# Altium project IncuNest.PrjPcb (part 1 of 2)
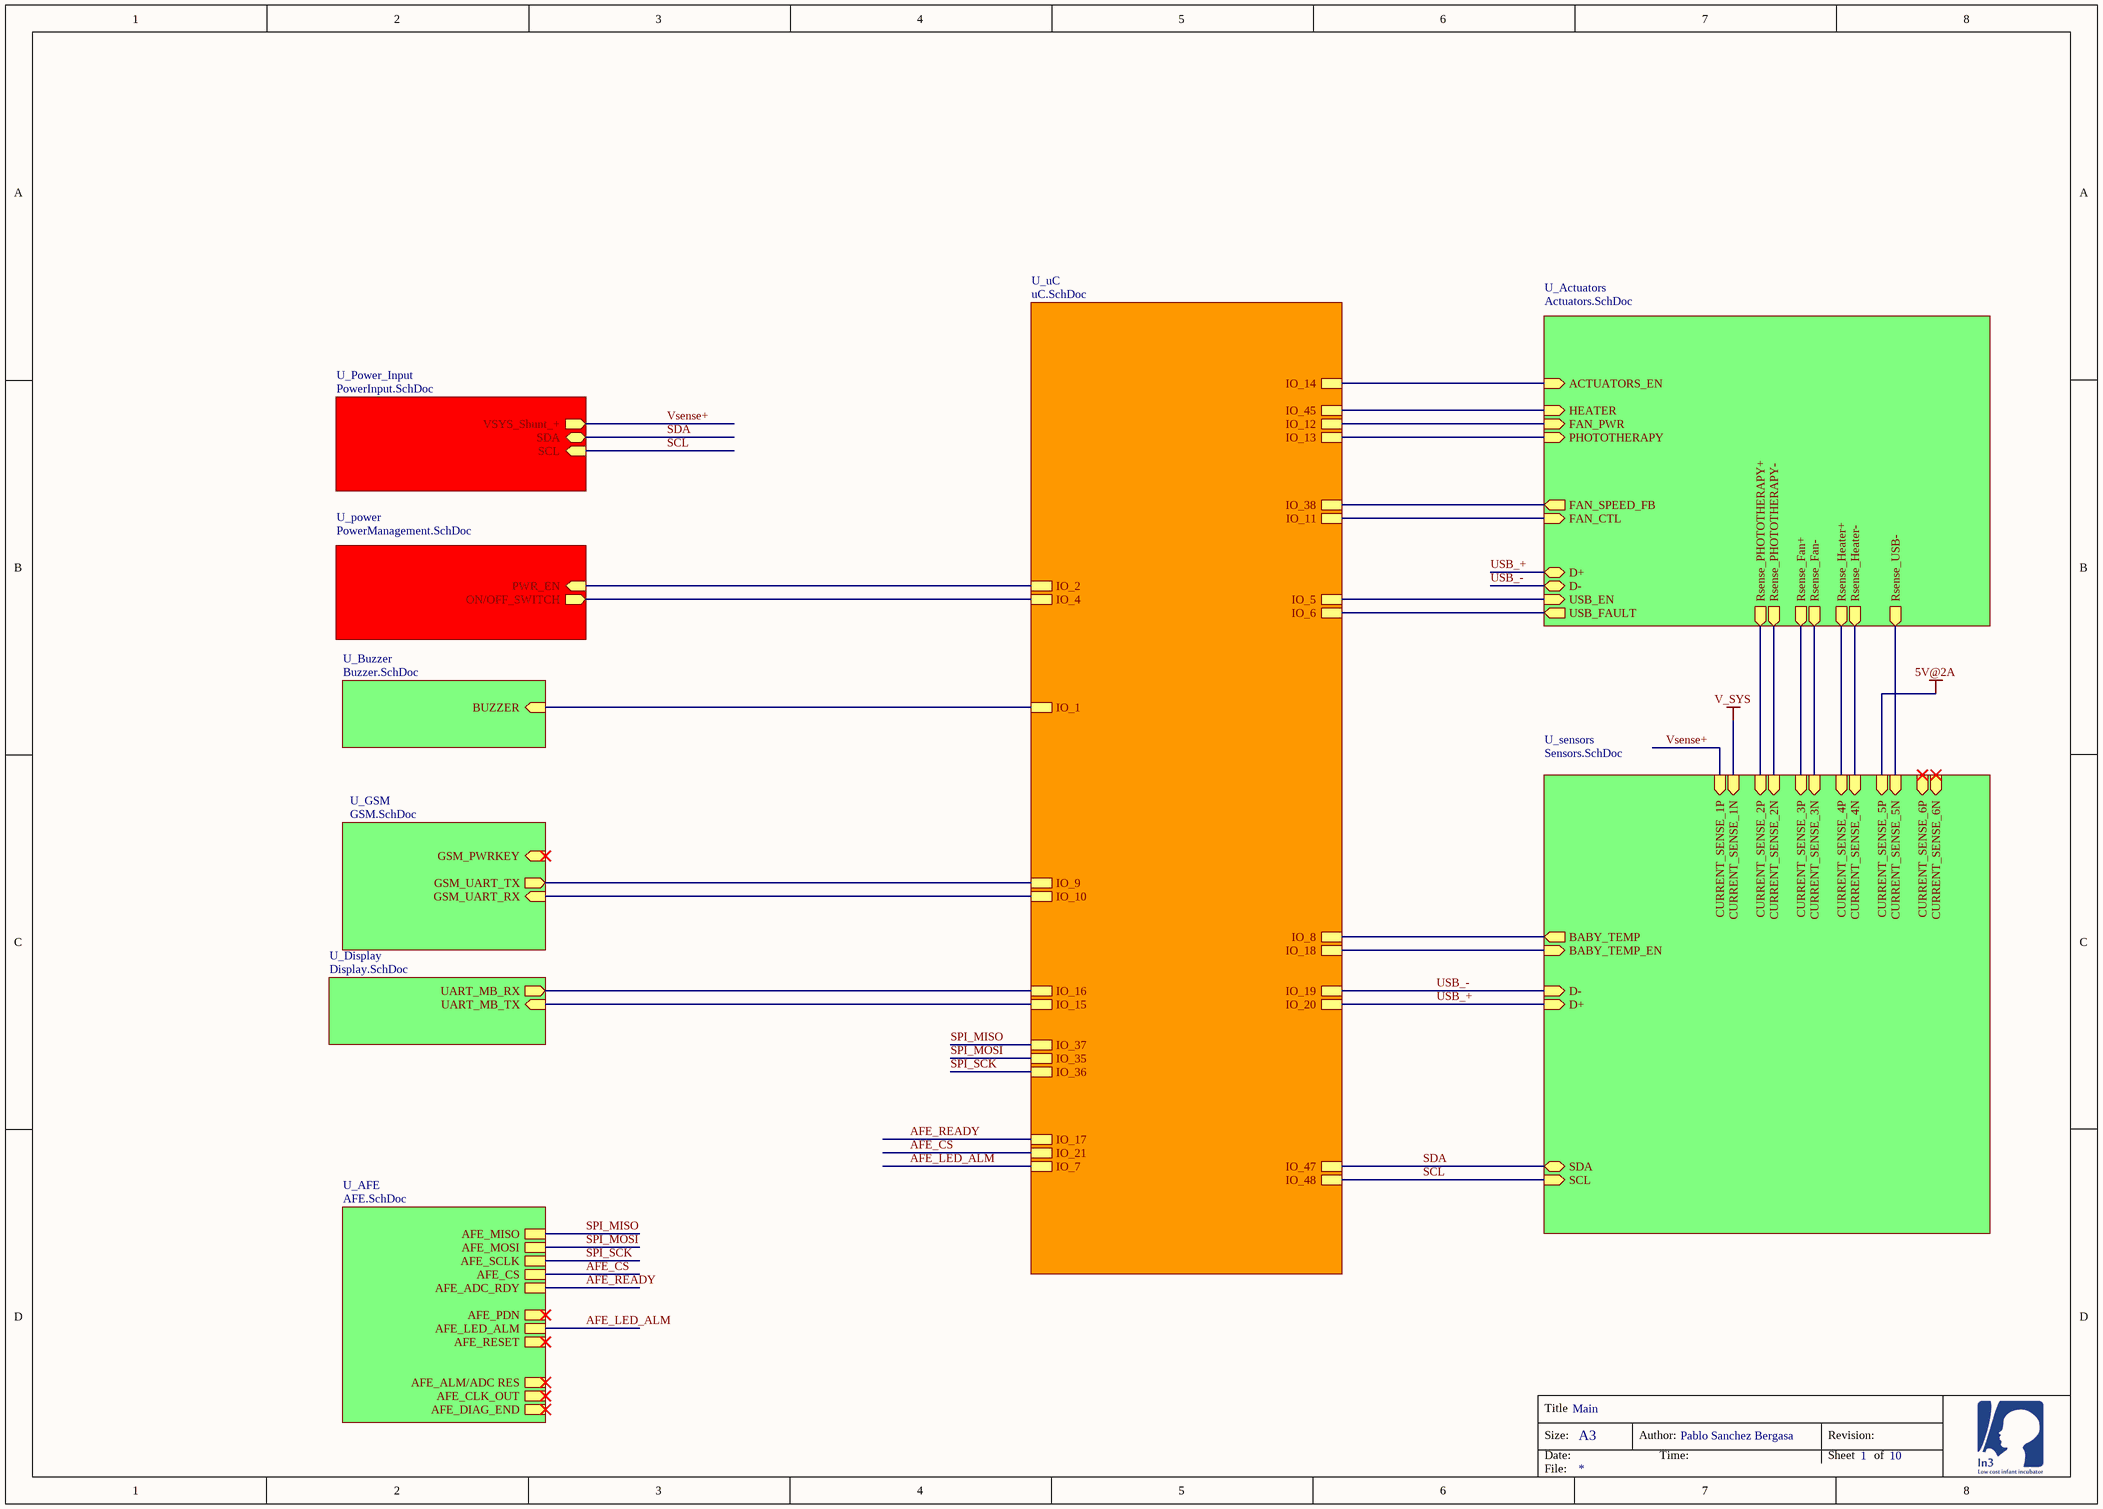
[diagram p0: Main.SchDoc]
Author_in3: Pablo Sanchez Bergasa; SheetTotal_in3: 10
10 sheets, 260 parts. Net scope: hierarchical (ports join the sheet entries above them; power ports are global).
Board file: Motherboard.PcbDoc
Sheets:
  Main.SchDoc
    U_power = PowerManagement.SchDoc
    U_GSM = GSM.SchDoc
    U_sensors = Sensors.SchDoc
    U_uC = uC.SchDoc
    U_Power_Input = PowerInput.SchDoc
    U_Actuators = Actuators.SchDoc
    U_Buzzer = Buzzer.SchDoc
    U_AFE = AFE.SchDoc
    U_Display = Display.SchDoc

## Sheet Main.SchDoc: Main
size A3; Date: 17/09/18; Author: Pablo Sánchez Bergasa; Revision: 2.A.1; SheetNumber: 1; SheetTotal: 10; DocumentName: Main

### Sub-sheets
U_Actuators = Actuators.SchDoc: HEATER (in), PHOTOTHERAPY (in), Rsense_Fan+ (out), Rsense_Fan- (out), Rsense_PHOTOTHERAPY+ (out), Rsense_PHOTOTHERAPY- (out), ACTUATORS_EN (in), FAN_SPEED_FB (out), Rsense_Heater- (out), Rsense_Heater+ (out), Rsense_USB- (out), USB_EN (in), USB_FAULT (out), FAN_PWR (in), FAN_CTL (in), D+ (bidir), D- (bidir)
U_AFE = AFE.SchDoc: AFE_SCLK, AFE_MISO, AFE_MOSI, AFE_CS, AFE_PDN, AFE_ADC_RDY, AFE_DIAG_END, AFE_LED_ALM, AFE_ALM/ADC RES, AFE_CLK_OUT, AFE_RESET
U_Buzzer = Buzzer.SchDoc: BUZZER (in)
U_Display = Display.SchDoc: UART_MB_TX (in), UART_MB_RX (out)
U_GSM = GSM.SchDoc: GSM_UART_TX (out), GSM_UART_RX (in), GSM_PWRKEY (in)
U_power = PowerManagement.SchDoc: PWR_EN (in), ON/OFF_SWITCH (out)
U_Power_Input = PowerInput.SchDoc: VSYS_Shunt_+ (out), SDA (bidir), SCL (in)
U_sensors = Sensors.SchDoc: BABY_TEMP (out), CURRENT_SENSE_1N (in), CURRENT_SENSE_3N (in), CURRENT_SENSE_2N (in), CURRENT_SENSE_1P (in), CURRENT_SENSE_3P (in), CURRENT_SENSE_2P (in), SCL (in), SDA (bidir), CURRENT_SENSE_6P (in), CURRENT_SENSE_5N (in), CURRENT_SENSE_4P (in), CURRENT_SENSE_4N (in), CURRENT_SENSE_6N (in), CURRENT_SENSE_5P (in), BABY_TEMP_EN (in), D+ (in), D- (in)
U_uC = uC.SchDoc: IO_5, IO_35, IO_37, IO_36, IO_7, IO_21, IO_15, IO_18, IO_14, IO_19, IO_20, IO_38, IO_13, IO_12, IO_16, IO_2, IO_1, IO_11, IO_4, IO_6, IO_8, IO_17, IO_45, IO_9, IO_10, IO_48, IO_47

### Nets
DC_ACTUATORS: sheet U_sensors/CURRENT_SENSE_3P, sheet U_sensors/CURRENT_SENSE_2P, sheet U_Actuators/Rsense_Fan+, sheet U_Actuators/Rsense_PHOTOTHERAPY+
AFE_CS: sheet U_uC/IO_21, sheet U_AFE/AFE_CS
AFE_LED_ALM: sheet U_uC/IO_7, sheet U_AFE/AFE_LED_ALM
AFE_READY: sheet U_uC/IO_17, sheet U_AFE/AFE_ADC_RDY
BABY_TEMP: sheet U_sensors/BABY_TEMP, sheet U_uC/IO_8
FAN+: sheet U_sensors/CURRENT_SENSE_3N, sheet U_Actuators/Rsense_Fan-
GSM_RX: sheet U_GSM/GSM_UART_RX, sheet U_uC/IO_10
GSM_TX: sheet U_GSM/GSM_UART_TX, sheet U_uC/IO_9
HEATER: sheet U_sensors/CURRENT_SENSE_4P, sheet U_Actuators/Rsense_Heater+
PHOTOTHERAPY+: sheet U_sensors/CURRENT_SENSE_2N, sheet U_Actuators/Rsense_PHOTOTHERAPY-
SCL: sheet U_sensors/SCL, sheet U_uC/IO_48, sheet U_Power_Input/SCL
SDA: sheet U_sensors/SDA, sheet U_uC/IO_47, sheet U_Power_Input/SDA
SPI_MISO: sheet U_uC/IO_37, sheet U_AFE/AFE_MISO
SPI_MOSI: sheet U_uC/IO_35, sheet U_AFE/AFE_MOSI
SPI_SCK: sheet U_uC/IO_36, sheet U_AFE/AFE_SCLK
USB_+: sheet U_sensors/D+, sheet U_uC/IO_20, sheet U_Actuators/D+  [project net D_P]
USB_-: sheet U_sensors/D-, sheet U_uC/IO_19, sheet U_Actuators/D-  [project net D_N]
Vsense+: sheet U_sensors/CURRENT_SENSE_1P, sheet U_Power_Input/VSYS_Shunt_+
NetD14_2: sheet U_power/PWR_EN, sheet U_uC/IO_2
NetJ5_3: sheet U_uC/IO_38, sheet U_Actuators/FAN_SPEED_FB
NetJ5_4: sheet U_uC/IO_11, sheet U_Actuators/FAN_CTL
NetJ10_4: sheet U_uC/IO_16, sheet U_Display/UART_MB_RX
NetJ10_6: sheet U_uC/IO_15, sheet U_Display/UART_MB_TX
NetQ2_4: sheet U_sensors/CURRENT_SENSE_4N, sheet U_Actuators/Rsense_Heater-
NetR3_2: sheet U_uC/IO_45, sheet U_Actuators/HEATER
NetR10_2: sheet U_uC/IO_14, sheet U_Actuators/ACTUATORS_EN
NetR14_1: sheet U_uC/IO_12, sheet U_Actuators/FAN_PWR
NetR19_2: sheet U_sensors/CURRENT_SENSE_5N, sheet U_Actuators/Rsense_USB-
NetR22_1: sheet U_uC/IO_13, sheet U_Actuators/PHOTOTHERAPY
NetR47_1: sheet U_uC/IO_1, sheet U_Buzzer/BUZZER
NetR75_1: sheet U_power/ON/OFF_SWITCH, sheet U_uC/IO_4
NetR83_2: sheet U_sensors/BABY_TEMP_EN, sheet U_uC/IO_18
NetU1_5: sheet U_uC/IO_5, sheet U_Actuators/USB_EN
NetU1_6: sheet U_uC/IO_6, sheet U_Actuators/USB_FAULT

### Notes on the sheet
- Title
- Size:
- Date:
- A3
- Author:
- Time:
- Revision:
- Sheet
- of
- File:

## Sheet PowerManagement.SchDoc: Power
size A3; SheetNumber: 3; SheetTotal: 10
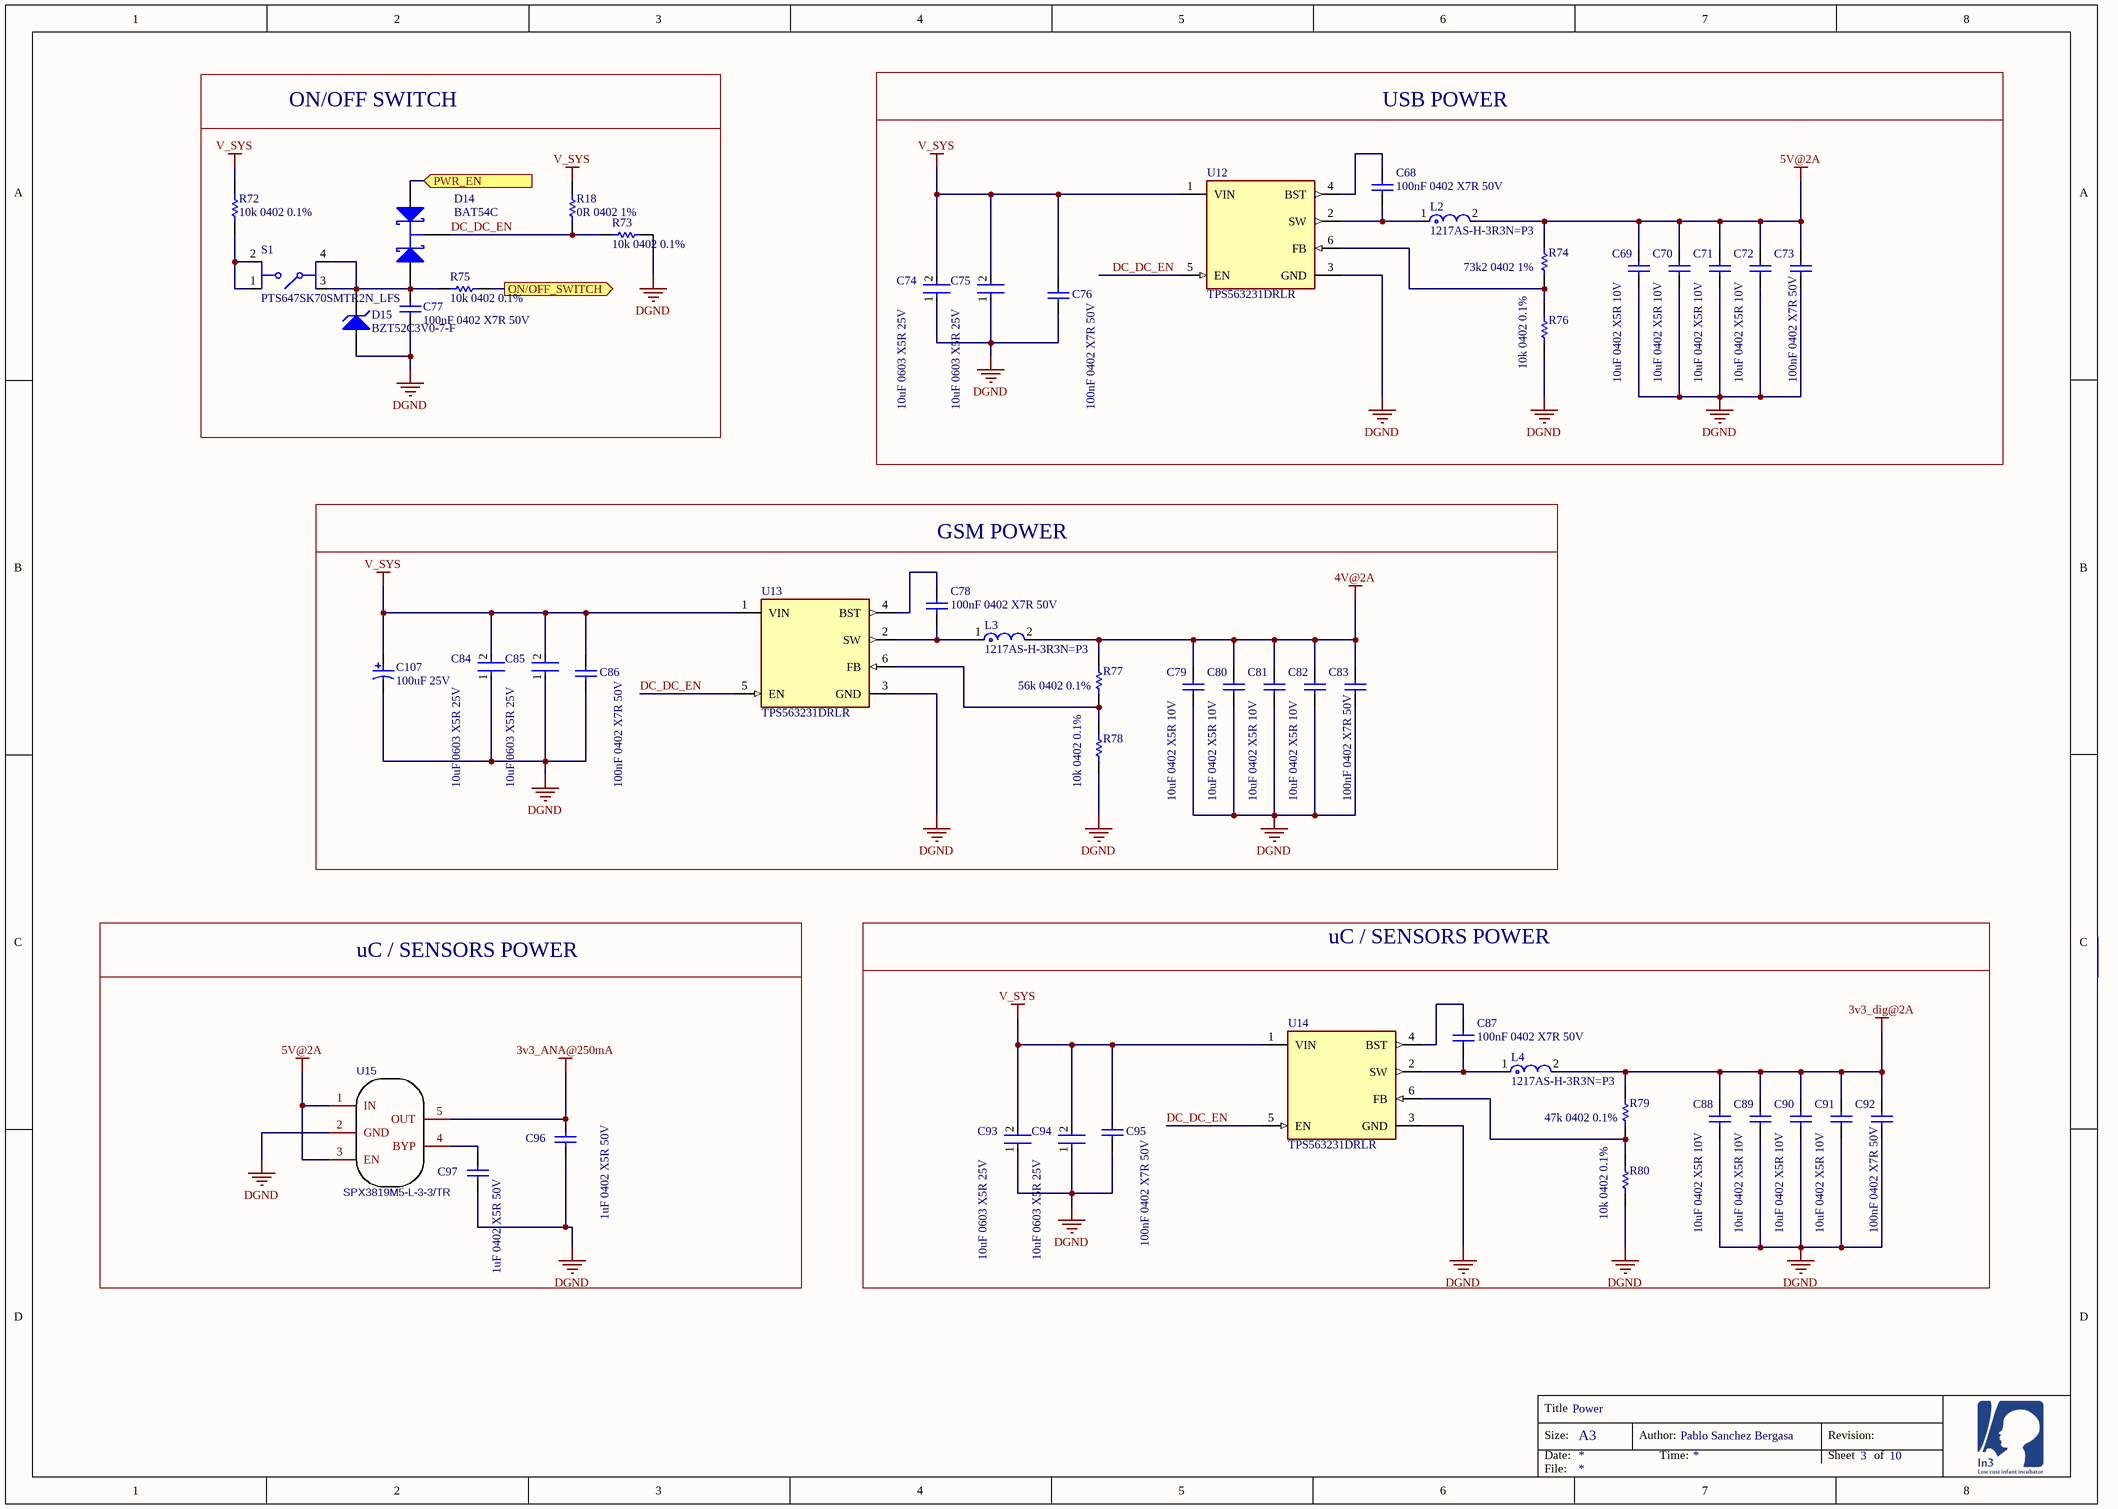
[diagram p1: PowerManagement.SchDoc]

### Parts
C68  100nF 0402 X7R 50V  [CAPC1005X55X25NL5T10]
C69  10uF 0402 X5R 10V  [CAPC1005X55X25NL5T10]
C70  10uF 0402 X5R 10V  [CAPC1005X55X25NL5T10]
C71  10uF 0402 X5R 10V  [CAPC1005X55X25NL5T10]
C72  10uF 0402 X5R 10V  [CAPC1005X55X25NL5T10]
C73  100nF 0402 X7R 50V  [CAPC1005X55X25NL5T10]
C74  10uF 0603 X5R 25V  [FP-GRM188-0_2-IPC_B]
C75  10uF 0603 X5R 25V  [FP-GRM188-0_2-IPC_B]
C76  100nF 0402 X7R 50V  [CAPC1005X55X25NL5T10]
C77  100nF 0402 X7R 50V  [CAPC1005X55X25NL5T10]
C78  100nF 0402 X7R 50V  [CAPC1005X55X25NL5T10]
C79  10uF 0402 X5R 10V  [CAPC1005X55X25NL5T10]
C80  10uF 0402 X5R 10V  [CAPC1005X55X25NL5T10]
C81  10uF 0402 X5R 10V  [CAPC1005X55X25NL5T10]
C82  10uF 0402 X5R 10V  [CAPC1005X55X25NL5T10]
C83  100nF 0402 X7R 50V  [CAPC1005X55X25NL5T10]
C84  10uF 0603 X5R 25V  [FP-GRM188-0_2-IPC_B]
C85  10uF 0603 X5R 25V  [FP-GRM188-0_2-IPC_B]
C86  100nF 0402 X7R 50V  [CAPC1005X55X25NL5T10]
C87  100nF 0402 X7R 50V  [CAPC1005X55X25NL5T10]
C88  10uF 0402 X5R 10V  [CAPC1005X55X25NL5T10]
C89  10uF 0402 X5R 10V  [CAPC1005X55X25NL5T10]
C90  10uF 0402 X5R 10V  [CAPC1005X55X25NL5T10]
C91  10uF 0402 X5R 10V  [CAPC1005X55X25NL5T10]
C92  100nF 0402 X7R 50V  [CAPC1005X55X25NL5T10]
C93  10uF 0603 X5R 25V  [FP-GRM188-0_2-IPC_B]
C94  10uF 0603 X5R 25V  [FP-GRM188-0_2-IPC_B]
C95  100nF 0402 X7R 50V  [CAPC1005X55X25NL5T10]
C96  1uF 0402 X5R 50V  [CAPC1005X55X25NL5T10]
C97  1uF 0402 X5R 50V  [CAPC1005X55X25NL5T10]
C107  100uF 25V  [CAPAE7067X55L]
D14  BAT54C  [NXP-SOT23-3_V]
D15  BZT52C3V0-7-F  [DIOD-SOD123_V]
L2  1217AS-H-3R3N=P3  [FP-DEM8045C-MFG]
L3  1217AS-H-3R3N=P3  [FP-DEM8045C-MFG]
L4  1217AS-H-3R3N=P3  [FP-DEM8045C-MFG]
R18  0R 0402 1%  [RESC1005X40X25ML05T10]
R72  10k 0402 0.1%  [RESC1005X40X25ML05T10]
R73  10k 0402 0.1%  [RESC1005X40X25ML05T10]
R74  73k2 0402 1%  [RESC1005X40X25ML05T10]
R75  10k 0402 0.1%  [RESC1005X40X25ML05T10]
R76  10k 0402 0.1%  [RESC1005X40X25ML05T10]
R77  56k 0402 0.1%  [RESC1005X40X25ML05T10]
R78  10k 0402 0.1%  [RESC1005X40X25ML05T10]
R79  47k 0402 0.1%  [RESC1005X40X25ML05T10]
R80  10k 0402 0.1%  [RESC1005X40X25ML05T10]
S1  PTS647SK70SMTR2N_LFS  [PTS647SK70SMTR2NLFS]
U12  TPS563231DRLR  [FP-DRL0006A-MFG]
U13  TPS563231DRLR  [FP-DRL0006A-MFG]
U14  TPS563231DRLR  [FP-DRL0006A-MFG]
U15  SPX3819M5-L-3-3/TR  [SOT-23-5_L3.0-W1.7-P0.95-LS2.8-BR]

### Blocks framed on the sheet
USB POWER: C68-C76 L2 R74 R76 U12
ON/OFF SWITCH: C77 D14 D15 R18 R72 R73 R75 S1
GSM POWER: C78-C86 C107 L3 R77 R78 U13
uC / SENSORS POWER: C87-C95 L4 R79 R80 U14
uC / SENSORS POWER: C96 C97 U15

### Ports
ON/OFF_SWITCH (out), PWR_EN (in)

### Nets
3v3_ANA@250mA: C96.2 U15.5(OUT)
3v3_dig@2A: C88.2 C89.2 C90.2 C91.2 C92.2 L4.2 R79.2
4V@2A: C79.2 C80.2 C81.2 C82.2 C83.2 L3.2 R77.2
5V@2A: C69.2 C70.2 C71.2 C72.2 C73.2 L2.2 R74.2 U15.1(IN) U15.3(EN)
DGND: C69.1 C70.1 C71.1 C72.1 C73.1 C74.1 C75.1 C76.1 C77.1 C79.1 C80.1 C81.1 C82.1 C83.1 C84.1 C85.1 C86.1 C88.1 C89.1 C90.1 C91.1 C92.1 C93.1 C94.1 C95.1 C96.1 C97.1 C107.2 D15.1(A) R73.1 R76.1 R78.1 R80.1 U12.3(GND) U13.3(GND) U14.3(GND) U15.2(GND)
V_SYS: C74.2 C75.2 C76.2 C84.2 C85.2 C86.2 C93.2 C94.2 C95.2 C107.1 R18.1 R72.1 U12.1(VIN) U13.1(VIN) U14.1(VIN)
DC_DC_EN: D14.3(K) R18.2 R73.2 U12.5(EN) U13.5(EN) U14.5(EN)
NetC68_1: C68.1 L2.1 U12.2(SW)
NetC68_2: C68.2 U12.4(BST)
NetC77_2: C77.2 D14.1(A) D15.2(K) R75.2 S1.3(COM_1) S1.4(COM_2)
NetC78_1: C78.1 L3.1 U13.2(SW)
NetC78_2: C78.2 U13.4(BST)
NetC87_1: C87.1 L4.1 U14.2(SW)
NetC87_2: C87.2 U14.4(BST)
NetC97_2: C97.2 U15.4(BYP)
NetD14_2: D14.2(A) ; port PWR_EN
NetR72_2: R72.2 S1.1(NO_1) S1.2(NO_2)
NetR74_1: R74.1 R76.2 U12.6(FB)
NetR75_1: R75.1 ; port ON/OFF_SWITCH
NetR77_1: R77.1 R78.2 U13.6(FB)
NetR79_1: R79.1 R80.2 U14.6(FB)

### Notes on the sheet
- Title
- Size:
- Date:
- A3
- Author:
- Time:
- Revision:
- Sheet
- of
- File:

### Library data of the parts
C68-C73 C76-C83 C86-C92 C95-C97 = CMP-1662-00020-1: ComponentLink2Description: Datasheet; ComponentLink2URL: http://psearch.en.murata.com/capacitor/product/GRM155R60J105KE19%23.pdf; ComponentLink1Description: Manufacturer URL; ComponentLink1URL: http://www.murata.com/
  C68 C73 C76-C78 C83 C86 C87 C92 C95: LCSC_PN: C77020
  C69-C72 C79-C82 C88-C91: LCSC_PN: C77000
  C96 C97: LCSC_PN: C1518208
C74 C75 C84 C85 C93 C94 = CMP-06035-022879-1: LCSC_PN: C91606
C107 = CMP-2000-07374-1: Aluminum Electrolytic Capacitor, 100 uF, +/- 20%, 16 V, -40 to 85 degC, 2-Pin SMD, RoHS, Tape and Reel; Manufacturer: Nichicon; Type: Can; Rated Voltage: 16V; Capacitance: 100µF; Case Size/Dimension: Ø6.3x5.4mm; Mounting Technology: SurfaceMount; Datasheet Version: 08/2015; Operating Temp-Max: 85°C; Datasheet URL: http://nichicon-us.com/english/products/pdfs/e-uwx.pdf; Package Description: 2-Pin Surface Mount Device, Body 6.6 x 6.6 mm; Package Reference: CAPAE7067X55; Manufacturer URL: http://www.nichicon.co.jp/english/; LCSC_PN: C7469933
D14 = CMP-0417-00003-1: Schottky Barrier Diode, 30 V, 2 uA, -55 to 150 degC, 3-Pin SOT23, RoHS, Tape and Reel; Manufacturer: NXP Semiconductors; IR (uA): 2; VF (mV): 800; Trr (ns): 5; Cd (pF): 10; VR (V): 30; Rth(j-a) (K/W): 500; RoHS: TRUE; Packing: Tape and Reel; ComponentLink2URL: http://www.nxp.com/documents/data_sheet/BAT54_SER.pdf; PartNumber: BAT54C; ComponentLink2Description: Datasheet; Temperature Range: -55 to 150 degC; PackageReference: SOT23-3; PackageDescription: 3-Pin Plastic Surface-mounted Package, Body 1.3 x 2.9 mm, Pitch 0.95 mm; Mounting Technology: Surface Mount; ComponentLink1URL: http://www.nxp.com/; DatasheetVersion: Rev. 5; ComponentLink1Description: Manufacturer URL; LCSC_PN: C181200
D15 = CMP-2000-05974-1: Surface Mount Zener Diode, 3 V, -65 to 150 degC, 2-Pin SOD123, RoHS, Tape and Reel; Unit Weight: 0.000353oz; Voltage Temperature Coefficient: -1.75mV/C; Zener Current: 5mA; Zz - Zener Impedance: 95Ohms; Pd - Power Dissipation: 500mW; Configuration: Single; Voltage Tolerance: 5%; Vz - Zener Voltage: 3V; Brand: DiodesIncorporated; Ir - Reverse Current: 10uA; Package Description: 2-Pin Surface Mount Device, Body 2.7 x 1.55 mm; Length: 2.85mm; Package Reference: SOD123; Width: 1.7mm; RoHS: True; Packaging: Reel; Datasheet Version: Rev. 37-2, 09/2012; Datasheet URL: http://www.diodes.com/_files/datasheets/ds18004.pdf; Maximum Operating Temperature: +150C; Product Category: ZenerDiodes; Minimum Operating Temperature: -65C; Mounting Technology: SurfaceMount; Mounting Style: SMD/SMT; Series: BZT52C; Height: 1.35mm; Factory Pack Quantity: 3000; Manufacturer URL: http://www.diodes.com/; Package / Case: SOD-123; Termination Style: SMD/SMT; Manufacturer: DiodesIncorporated; LCSC_PN: C85212
L2-L4 = CMP-06042-006799-1: Shielded Wirewound Inductor 3.3uH 30% 6800mA 0.0144Ω SMD; Saturation Current: 7.7A; Core Material: Ferrite; Current Rating: 6.8A; Test Frequency: 100kHz; DC Resistance (DCR): 14.4mR; Height - Seated (Max): 0.177inch; Packaging: Tape and Reel; Resistor Type: Wirewound; Tolerance: 30%; Inductance: 3.3uH; Length: 0.315inch; Number of Pins: 2; Case/Package: SMD/SMT; Mount: Surface Mount; Max DC Current: 6.8A; Width: 0.315inch; Shielding: Shielded; LCSC_PN: C514864
R18 R72 R73 R75-R80 = CMP-2002-07472-1
  R18: LCSC_PN: C60485
  R72 R73 R75 R76 R78 R80: LCSC_PN: C190095
  R77: LCSC_PN: C114756
  R79: LCSC_PN: C93943
R74 = CMP-2002-07472-1: Manufacturer: Yageo / Phycomp; LCSC_PN: C185398
S1 = PTS647SK70SMTR2N_LFS: Switch (4-Pin Push); Manufacturer_Name: C & K COMPONENTS; Manufacturer_Part_Number: PTS647SK70SMTR2N LFS; Datasheet Link: https://www.ckswitches.com/media/2567/pts647.pdf; Height: 7mm; LCSC_PN: C47324878
U12-U14 = CMP-04918-000435-1: POWER MANAGEMENT; LCSC_PN: C779412
U15 = SPX3819M5-L-3-3/TR: BOM_Manufacturer: EXAR; BOM_Supplier: LCSC; BOM_Manufacturer Part: SPX3819M5-L-3-3/TR; BOM_Supplier Part: C9055; BOM_JLCPCB Part Class: Extended Part; spicePre: U; spiceSymbolName: SPX3819M5-L-3-3/TR; LCSC_PN: C9055

## Sheet GSM.SchDoc: GSM
size A4; SheetNumber: 8; SheetTotal: 10
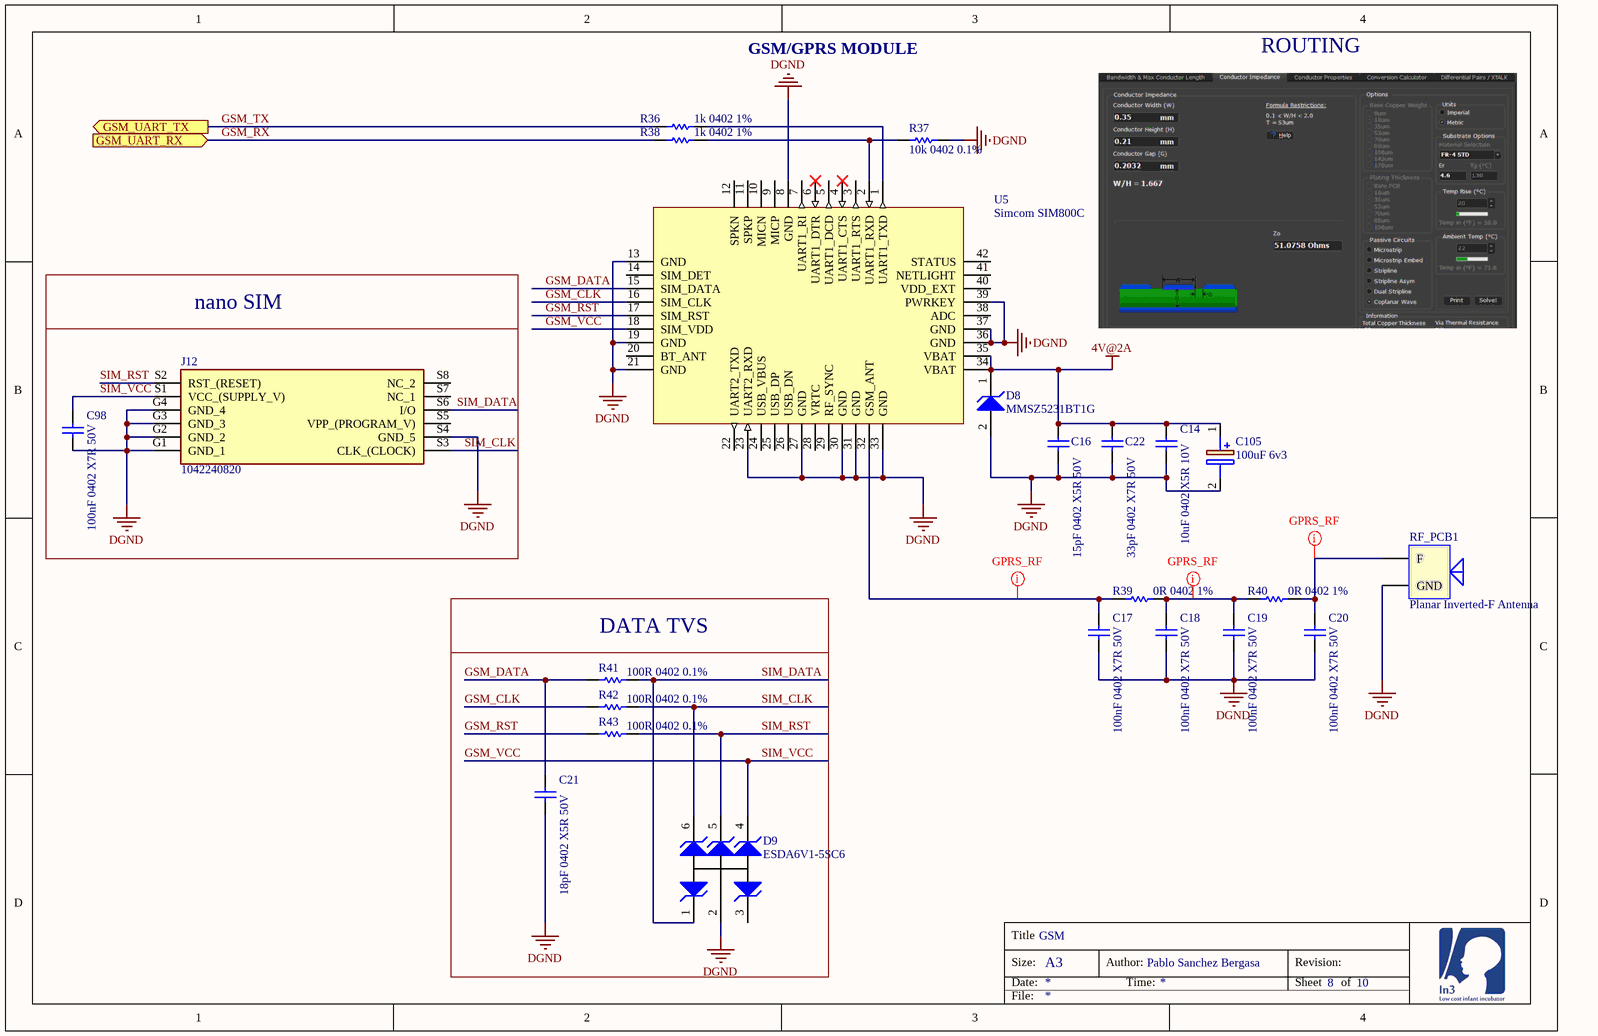
[diagram p2: GSM.SchDoc]

### Parts
C14  10uF 0402 X5R 10V  [CAPC1005X55X25NL5T10]
C16  15pF 0402 X5R 50V  [CAPC1005X55X25NL5T10]
C17  100nF 0402 X7R 50V  [CAPC1005X55X25NL5T10]
C18  100nF 0402 X7R 50V  [CAPC1005X55X25NL5T10]
C19  100nF 0402 X7R 50V  [CAPC1005X55X25NL5T10]
C20  100nF 0402 X7R 50V  [CAPC1005X55X25NL5T10]
C21  18pF 0402 X5R 50V  [CAPC1005X55X25NL5T10]
C22  33pF 0402 X7R 50V  [CAPC1005X55X25NL5T10]
C98  100nF 0402 X7R 50V  [CAPC1005X55X25NL5T10]
C105  100uF 6v3  [CAPPM3216X180N]
D8  MMSZ5231BT1G  [ONSC-SOD-123-2-425-04_V]
D9  ESDA6V1-5SC6  [MF06A_N]
J12  1042240820  [1042240820]
R36  1k 0402 1%  [RESC1005X40X25ML05T10]
R37  10k 0402 0.1%  [RESC1005X40X25ML05T10]
R38  1k 0402 1%  [RESC1005X40X25ML05T10]
R39  0R 0402 1%  [RESC1005X40X25ML05T10]
R40  0R 0402 1%  [RESC1005X40X25ML05T10]
R41  100R 0402 0.1%  [RESC1005X40X25ML05T10]
R42  100R 0402 0.1%  [RESC1005X40X25ML05T10]
R43  100R 0402 0.1%  [RESC1005X40X25ML05T10]
RF_PCB1  Planar Inverted-F Antenna  [PCB-k9titb4465gfk1ijwrnj-1]  (no BOM)
U5  Simcom SIM800C  [SIM800C]

### Blocks framed on the sheet
nano SIM: C98 J12
DATA TVS: C21 D9 R41-R43

### Ports
GSM_UART_RX (in), GSM_UART_TX (out)

### Nets
4V@2A: C14.2 C16.2 C22.1 C105.1(+) D8.1(K) U5.34(VBAT) U5.35(VBAT)
DGND: C14.1 C16.1 C17.1 C18.1 C19.1 C20.1 C21.1 C22.2 C98.1 C105.2(-) D8.2(A) D9.2(K) J12.G1(GND_1) J12.G2(GND_2) J12.G3(GND_3) J12.G4(GND_4) J12.S4(GND_5) R37.1 RF_PCB1.2(GND) U5.8(GND) U5.13(GND) U5.19(GND) U5.21(GND) U5.23(UART2_RXD) U5.27(GND) U5.30(GND) U5.31(GND) U5.33(GND) U5.36(GND) U5.37(GND) U5.39(PWRKEY)
GSM_CLK: R42.2 U5.16(SIM_CLK)
GSM_DATA: C21.2 R41.2 U5.15(SIM_DATA)
GSM_RST: R43.2 U5.17(SIM_RST)
GSM_RX: R38.2 ; port GSM_UART_RX
GSM_TX: R36.2 ; port GSM_UART_TX
GSM_VCC: C98.2 D9.4(A) J12.S1(VCC_(SUPPLY_V)) U5.18(SIM_VDD)  [also labelled SIM_VCC]
SIM_CLK: D9.6(A) J12.S3(CLK_(CLOCK)) R42.1
SIM_DATA: D9.1(K) J12.S6(I/O) R41.1
SIM_RST: D9.5(A) J12.S2(RST_(RESET)) R43.1
NetC17_2: C17.2 R39.2 U5.32(GSM_ANT)
NetC18_2: C18.2 C19.2 R39.1 R40.2
NetC20_2: C20.2 R40.1 RF_PCB1.1(F)
NetR36_1: R36.1 U5.1(UART1_TXD)
NetR37_2: R37.2 R38.1 U5.2(UART1_RXD)

Not connected (* = marked no-connect by the designer): D9 3(K); J12 S5(VPP_(PROGRAM_V)) S7(NC_1) S8(NC_2); U5 3(UART1_RTS) 4(UART1_CTS)* 5(UART1_DCD) 6(UART1_DTR)* 7(UART1_RI) 9(MICP) 10(MICN) 11(SPKP) 12(SPKN) 14(SIM_DET) 20(BT_ANT) 22(UART2_TXD) 24(USB_VBUS) 25(USB_DP) 26(USB_DN) 28(VRTC) 29(RF_SYNC) 38(ADC) 40(VDD_EXT) 41(NETLIGHT) 42(STATUS)

### Layout directives
net class GPRS_RF: NetC17_2, NetC18_2, NetC20_2

### Notes on the sheet
- GSM/GPRS MODULE
- ROUTING
- Title
- Size:
- Date:
- A3
- Author:
- Time:
- Revision:
- Sheet
- of
- File:

### Library data of the parts
C14 C16-C22 C98 = CMP-1662-00020-1: ComponentLink2Description: Datasheet; ComponentLink2URL: http://psearch.en.murata.com/capacitor/product/GRM155R60J105KE19%23.pdf; ComponentLink1Description: Manufacturer URL; ComponentLink1URL: http://www.murata.com/
  C14: LCSC_PN: C77000
  C16: LCSC_PN: C86285
  C17-C20 C98: LCSC_PN: C77020
  C21: LCSC_PN: C33149
  C22: LCSC_PN: C107005
C105 = TMCMA0J107MTRF: Capacitor Polarised; Manufacturer_Name: Vishay; Datasheet Link: http://www.vishay.com/docs/40178/tmcm.pdf; Height: 1.8mm; Manufacturer_Part_Number: TMCMA0J107MTRF; Mouser Part Number: 74-TMCMA0J107MTRF; Mouser Price/Stock: https://www.mouser.co.uk/ProductDetail/Vishay-Sprague/TMCMA0J107MTRF?qs=NgbZBzc1CyGhyyzGhg4Jvg%3D%3D; Arrow Part Number: TMCMA0J107MTRF; Arrow Price/Stock: https://www.arrow.com/en/products/tmcma0j107mtrf/vishay?utm_currency=USD&region=nac; LCSC_PN: C1954161
D8 = CMP-1060-00573-1: Zener Voltage Regulator, 500 mW, 2-Pin SOD-123, Pb-Free, Tape and Reel; Manufacturer: On Semiconductor; P Max (W): 0.5; VZ Typ (V): 5.1; PackageVersion: Rev. G, 10/2009; Mounting Technology: Surface Mount; ComponentLink2Description: Datasheet; ComponentLink3URL: http://www.onsemi.com/pub_link/Collateral/425-04.PDF; PackageDescription: 2-Pin SOD, Body 1.6 x 2.69 mm; Packing: Tape and Reel; ComponentLink2URL: http://www.onsemi.com/pub_link/Collateral/MMSZ5221BT1-D.PDF; ComponentLink1URL: http://www.onsemi.com/; PartNumber: MMSZ5231BT1G; PackageReference: SOD-123-2-425-04; RoHS: Pb-Free; ComponentLink1Description: Manufacturer URL; ComponentLink3Description: Package Specification; DatasheetVersion: Rev. 12; LCSC_PN: C2759896
D9 = CMP-924f5b40f9684d88-1: ESDA Series 5 Channel 6.1 V 50 pF SMT Uni Directional Transil Array - SOT-23-6L; Operating Voltage: 6.10 V; Power Rating: 100 W; Breakdown Voltage: 7.20 V; Lead-Free Status: Lead Free; REACH SVHC Compliance: No SVHC; Number of Pins: 6; Case/Package: SOT-23; Size-Width: 1.75 mm; Mounting Style: Surface Mount; Manufacturer Part Number: ESDA6V1-5SC6; Size-Height: 1.45 mm; OctopartID: 924f5b40f9684d88; Size-Length: 3.05 mm; Packaging: Tape & Reel (TR), Cut Tape (CT); Octopart URL: http://octopart.com/esda6v1-5sc6-stmicroelectronics-347713; RoHS: Compliant; Voltage Rating (DC): 6.10 V; Lifecycle Status: Active; TME: ESDA6V1-5SC6; LCSC Part: C6650; LCSC_PN: C2827672
J12 = 1042240820: Connector; Manufacturer_Name: Molex; Datasheet Link: https://www.molex.com/en-us/products/part-detail-pdf/1042240820?display=pdf; Height: 1.21mm; Manufacturer_Part_Number: 1042240820; Mouser Part Number: N/A; Mouser Price/Stock: https://www.mouser.com/Search/Refine.aspx?Keyword=N%2FA; Arrow Part Number: 1042240820; Arrow Price/Stock: https://www.arrow.com/en/products/1042240820/molex?utm_currency=USD&region=asia; LCSC_PN: C585349
R36-R43 = CMP-2002-07472-1
  R36 R38: LCSC_PN: C106235
  R37: LCSC_PN: C190095
  R39 R40: LCSC_PN: C60485
  R41-R43: LCSC_PN: C106233
RF_PCB1 = CMP-e704afk8c25r4a5ypw1c-12: GSM900 and GSM1800  Frequency Bands PCB antenna; CustomComponentID: e704afk8c25r4a5ypw1c
U5 = CMP-72dbb8ea0133ad1c-5: Module: GSM/Bluetooth; GPRS; 2G; 1800MHz, 900MHz; 85.6kbps; SMD; OctopartID: 72dbb8ea0133ad1c; Manufacturer Part Number: SIM800C; Mounting Style: Surface Mount; Octopart URL: http://octopart.com/sim800c-simcom-54220430; LCSC_PN: C2981431

## Sheet Sensors.SchDoc: Sensors
size A3; SheetNumber: 9; SheetTotal: 10
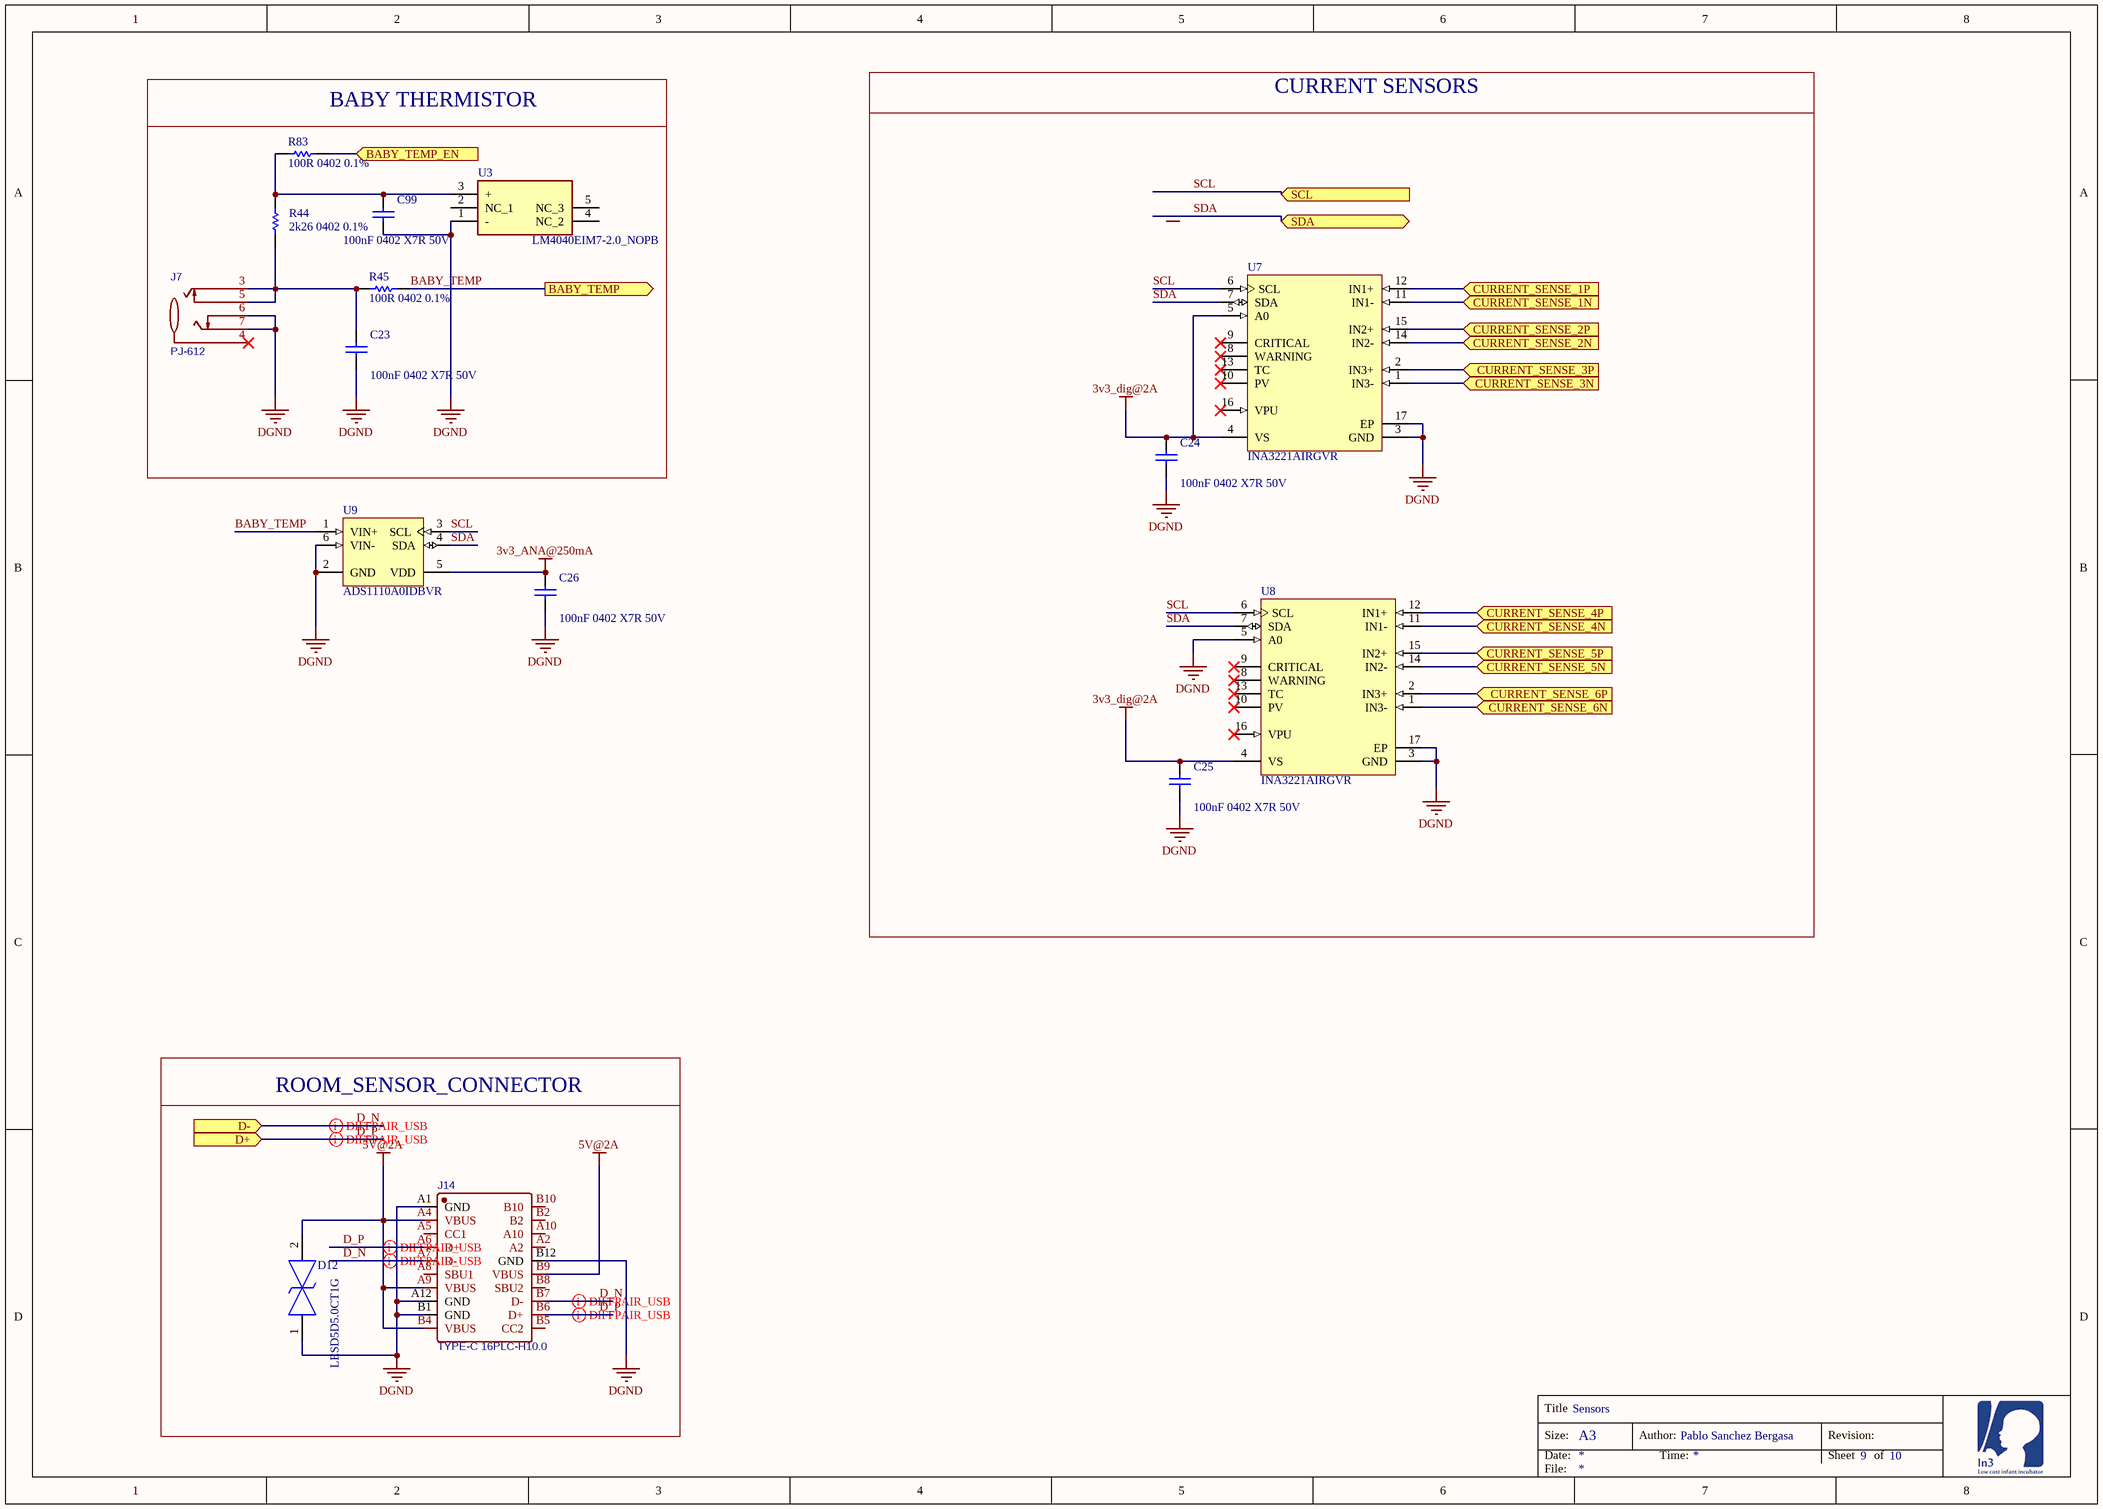
[diagram p3: Sensors.SchDoc]

### Parts
C23  100nF 0402 X7R 50V  [CAPC1005X55X25NL5T10]
C24  100nF 0402 X7R 50V  [CAPC1005X55X25NL5T10]
C25  100nF 0402 X7R 50V  [CAPC1005X55X25NL5T10]
C26  100nF 0402 X7R 50V  [CAPC1005X55X25NL5T10]
C99  100nF 0402 X7R 50V  [CAPC1005X55X25NL5T10]
D12  LESD5D5.0CT1G  [LESD5D50CT1G]
J7  PJ-612  [AUDIO-TH_PJ-612]
J14  TYPE-C 16PLC-H10.0  [TYPE-C-TH_16PLC-H10.0]
R44  2k26 0402 0.1%  [RESC1005X40X25ML05T10]
R45  100R 0402 0.1%  [RESC1005X40X25ML05T10]
R83  100R 0402 0.1%  [RESC1005X40X25ML05T10]
U3  LM4040EIM7-2.0_NOPB  [SOT65P210X110-5N]
U7  INA3221AIRGVR  [RGV0016A_V]
U8  INA3221AIRGVR  [RGV0016A_V]
U9  ADS1110A0IDBVR  [TI-DBV6_M]

### Blocks framed on the sheet
BABY THERMISTOR: C23 C99 J7 R44 R45 R83 U3
CURRENT SENSORS: C24 C25 U7 U8
ROOM_SENSOR_CONNECTOR: D12 J14

### Ports
BABY_TEMP (out), BABY_TEMP_EN (in), CURRENT_SENSE_1N (in), CURRENT_SENSE_1P (in), CURRENT_SENSE_2N (in), CURRENT_SENSE_2P (in), CURRENT_SENSE_3N (in), CURRENT_SENSE_3P (in), CURRENT_SENSE_4N (in), CURRENT_SENSE_4P (in), CURRENT_SENSE_5N (in), CURRENT_SENSE_5P (in), CURRENT_SENSE_6N (in), CURRENT_SENSE_6P (in), D+ (in), D- (in), SCL (in), SDA (bidir)

### Nets
3v3_ANA@250mA: C26.2 U9.5(VDD)
3v3_dig@2A: C24.2 C25.2 U7.4(VS) U7.5(A0) U8.4(VS)
5V@2A: D12.2 J14.A4(VBUS) J14.A9(VBUS) J14.B4(VBUS) J14.B9(VBUS) U8.15(IN2+) ; port CURRENT_SENSE_5P
DC_ACTUATORS: U7.2(IN3+) U7.15(IN2+) ; port CURRENT_SENSE_3P, port CURRENT_SENSE_2P
DGND: C23.1 C24.1 C25.1 C26.1 C99.1 D12.1 J7.6 J7.7 J14.A1(GND) J14.A12(GND) J14.B1(GND) J14.B12(GND) U3.1(-) U7.3(GND) U7.17(EP) U8.3(GND) U8.5(A0) U8.17(EP) U9.2(GND) U9.6(VIN-)
V_SYS: U7.11(IN1-) ; port CURRENT_SENSE_1N
BABY_TEMP: R45.2 U9.1(VIN+) ; port BABY_TEMP
D_N: J14.A7(D-) J14.B7(D-) ; port D-
D_P: J14.A6(D+) J14.B6(D+) ; port D+
FAN+: U7.1(IN3-) ; port CURRENT_SENSE_3N
HEATER: U8.12(IN1+) ; port CURRENT_SENSE_4P
PHOTOTHERAPY+: U7.14(IN2-) ; port CURRENT_SENSE_2N
SCL: U7.6(SCL) U8.6(SCL) U9.3(SCL) ; port SCL
SDA: U7.7(SDA) U8.7(SDA) U9.4(SDA) ; port SDA
Vsense+: U7.12(IN1+) ; port CURRENT_SENSE_1P
NetC23_2: C23.2 J7.3 J7.5 R44.1 R45.1
NetC99_2: C99.2 R44.2 R83.1 U3.3(+)
NetQ2_4: U8.11(IN1-) ; port CURRENT_SENSE_4N
NetR19_2: U8.14(IN2-) ; port CURRENT_SENSE_5N
NetR83_2: R83.2 ; port BABY_TEMP_EN
NetU8_1: U8.1(IN3-) ; port CURRENT_SENSE_6N
NetU8_2: U8.2(IN3+) ; port CURRENT_SENSE_6P

Not connected (* = marked no-connect by the designer): J7 4*; J14 A2 A5(CC1) A8(SBU1) A10 B2 B5(CC2) B8(SBU2) B10; U3 2(NC_1) 4(NC_2) 5(NC_3); U7 8(WARNING)* 9(CRITICAL)* 10(PV)* 13(TC)* 16(VPU)*; U8 8(WARNING)* 9(CRITICAL)* 10(PV)* 13(TC)* 16(VPU)*

### Layout directives
differential pair; differential pair class USB: D_N, D_P

### Notes on the sheet
- Title
- Size:
- Date:
- A3
- Author:
- Time:
- Revision:
- Sheet
- of
- File:

### Library data of the parts
C23-C26 C99 = CMP-1662-00020-1: ComponentLink2Description: Datasheet; ComponentLink2URL: http://psearch.en.murata.com/capacitor/product/GRM155R60J105KE19%23.pdf; ComponentLink1Description: Manufacturer URL; ComponentLink1URL: http://www.murata.com/; LCSC_PN: C77020
D12 = LESD5D5.0CT1G: TVS Diode (Bi-directional); Manufacturer_Name: LRC; Height: 0.7mm; Manufacturer_Part_Number: LESD5D5.0CT1G; LCSC_PN: C383211
J7 = PJ-612: Manufacturer: HOOYA(皓宇电子); Contributor: LCSC; Supplier: LCSC; Supplier Part: C309284; Manufacturer Part: PJ-612; JLCPCB Part Class: Extended Part; spicePre: J; spiceSymbolName: PJ-612; LCSC_PN: C309284
J14 = TYPE-C 16PLC-H10.0: Manufacturer: SHOU HAN(首韩); Contributor: lcsc; Supplier: LCSC; Supplier Part: C3151747; Manufacturer Part: TYPE-C 16PLC-H10.0; JLCPCB Part Class: Extended Part; spicePre: U; spiceSymbolName: TYPE-C 16PLC-H10.0; LCSC_PN: C3151747
R44 R45 R83 = CMP-2002-07472-1
  R44: LCSC_PN: C852697
  R45 R83: LCSC_PN: C106233
U3 = LM4040EIM7-2.0_NOPB: Integrated Circuit; Manufacturer_Name: Texas Instruments; Manufacturer_Part_Number: LM4040EIM7-2.0/NOPB; Datasheet Link: http://www.ti.com/lit/ds/symlink/lm4040-n.pdf; Height: 1.1mm; Mouser Part Number: 595-M4040EIM7-2.0NPB; Mouser Price/Stock: https://www.mouser.co.uk/ProductDetail/Texas-Instruments/LM4040EIM7-2.0-NOPB?qs=2k4gZbgf%2F9k9BIpEqTAQVA%3D%3D; Arrow Part Number: LM4040EIM7-2.0/NOPB; Arrow Price/Stock: https://www.arrow.com/en/products/lm4040eim7-2.0nopb/texas-instruments; LCSC_PN: C1848440
U7 U8 = CMP-0704-00001-2: Triple Channel Shunt and Bus Voltage Monitor, 120 dB, 2.7 to 5.5 V, -40 to 125 degC, 16-Pin VQFN (RGV), Green (RoHS & no Sb/Br), Tape and Reel; Manufacturer: Texas Instruments; Rating: Catalog; Quiescent Current (Typ): 350 uA; Gain Error (max): 0.25%; CMR (Typ): 120 dB; Offset Voltage (max): +/- 80 uV; Gain: 1 V/V; Voltage Input Range (Bus): 0 to 26 V; ComponentLink2Description: Datasheet; PackageDescription: 16-Pin Quad Flat No-lead Package, Body 4 x 4 mm, Pitch 0.65 mm; ComponentLink3URL: http://www.ti.com/lit/ds/symlink/ina3221.pdf; PartNumber: INA3221AIRGVR; Operating Supply Range: 2.7 to 5.5 V; DatasheetVersion: SBOS576A; Temperature Range: -40 to 125 degC; ComponentLink1Description: Manufacturer URL; ComponentLink1URL: http://www.ti.com/; RoHS: TRUE; ComponentLink3Description: Package Specification; Packing: Tape and Reel; Mounting Technology: Surface Mount; ComponentLink2URL: http://www.ti.com/lit/ds/symlink/ina3221.pdf; PackageVersion: SBOS576A; PackageReference: RGV0016A; LCSC_PN: C181255
U9 = CMP-0003-00257-2: 16-Bit Delta-Sigma ADC with Internal Reference, PGA and Oscillator, I2C Serial Interface, -40 to 85 degC, 6-pin SOT23 (DBV6), Green (RoHS & no Sb/Br); Manufacturer: Texas Instruments; # Input Channels: 1; Digital Supply(Max)(V): 5.5; Resolution(Bits): 16; Interface: Serial I2C; Digital Supply(Min)(V): 2.7; SubFamily: Precision ADC (<=10MSPS); Sample Rate (max)(SPS): 240; Mounting Technology: Surface Mount; PackageDescription: 6-Pin Plastic Small Outline, Body 1.6 x 2.9 mm, Pitch 0.95 mm; ComponentLink3URL: http://www.ti.com/litv/pdf/mpds026h; ComponentLink1Description: Manufacturer URL; PackageReference: DBV6; ComponentLink1URL: http://www.ti.com/; Eco-Plan: Green (RoHS & no Sb/Br); ComponentLink2URL: http://www.ti.com/general/docs/lit/getliterature.tsp?genericPartNumber=ADS1110&fileType=pdf; Analog Voltage AV/DD(Min)(V): 2.7; ComponentLink2Description: Datasheet; PartNumber: ADS1110A0IDBVR; ComponentLink3Description: Package Specification; PackageVersion: 4073253-5/K, 03/2006; Analog Voltage AV/DD(Max)(V): 5.5; Architecture: Delta-Sigma; Code_JEDEC: MO-178; DatasheetVersion: SBAS276A; LCSC_PN: C16598

## Sheet uC.SchDoc: uC
size A3; SheetNumber: 4; SheetTotal: 10
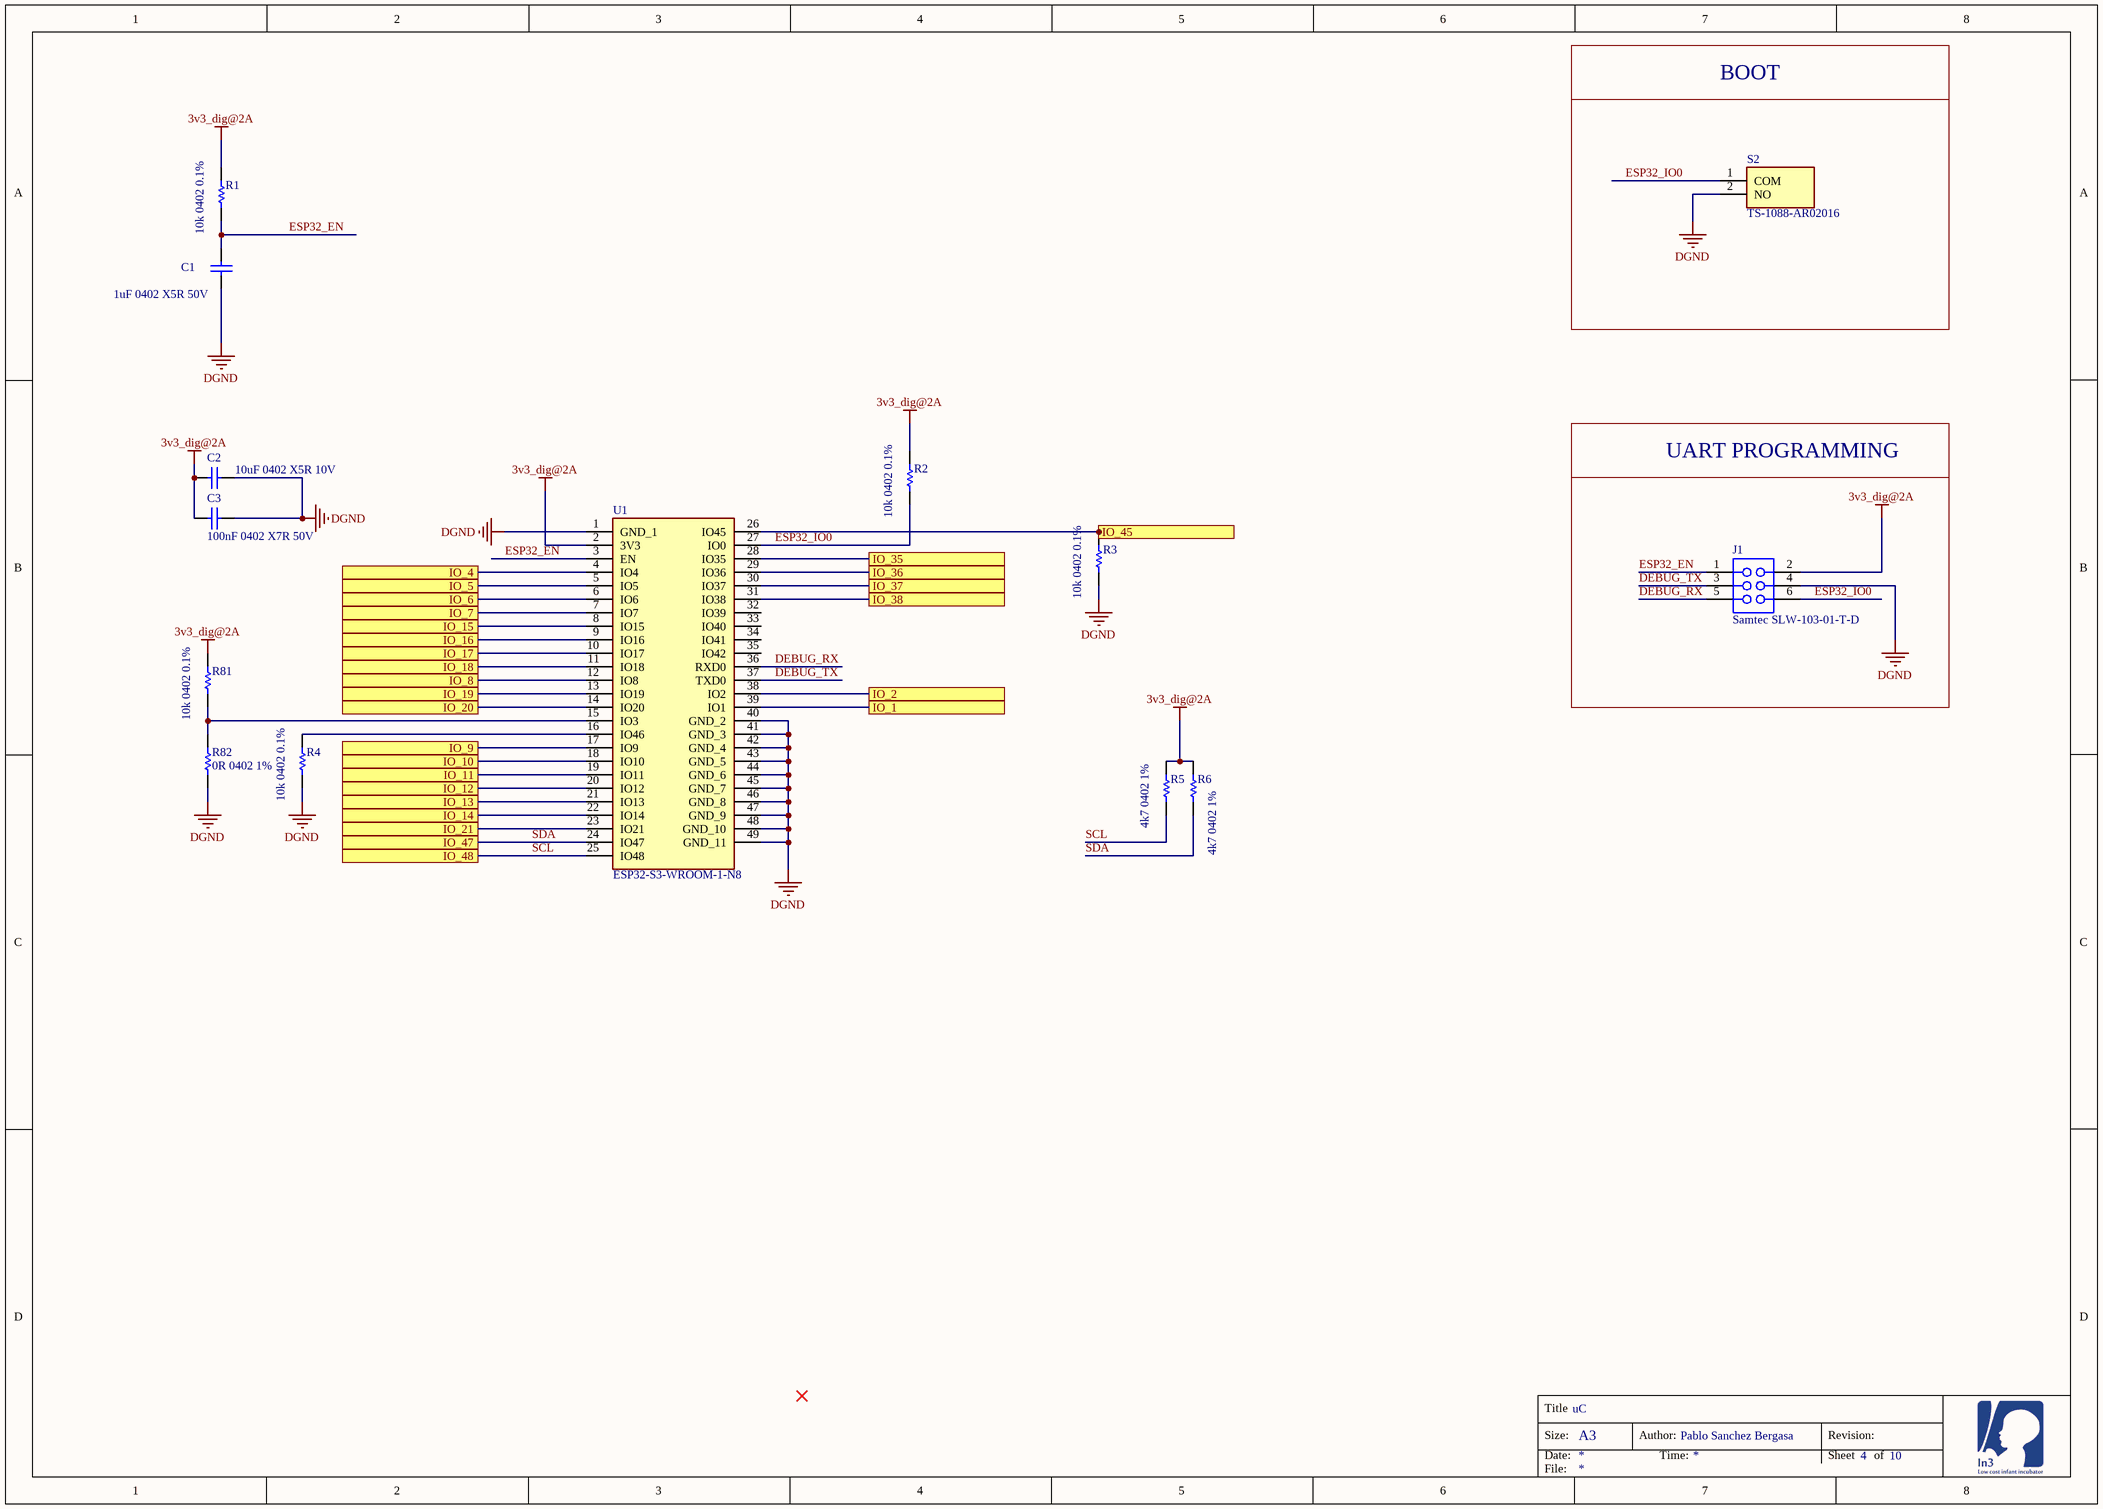
[diagram p4: uC.SchDoc]

### Parts
C1  1uF 0402 X5R 50V  [CAPC1005X55X25NL5T10]
C2  10uF 0402 X5R 10V  [CAPC1005X55X25NL5T10]
C3  100nF 0402 X7R 50V  [CAPC1005X55X25NL5T10]
J1  Samtec SLW-103-01-T-D  [PCB-37z8hw1ej4f71bosen9e-1]
R1  10k 0402 0.1%  [RESC1005X40X25ML05T10]
R2  10k 0402 0.1%  [RESC1005X40X25ML05T10]
R3  10k 0402 0.1%  [RESC1005X40X25ML05T10]
R4  10k 0402 0.1%  [RESC1005X40X25ML05T10]
R5  4k7 0402 1%  [RESC1005X40X25ML05T10]
R6  4k7 0402 1%  [RESC1005X40X25ML05T10]
R81  10k 0402 0.1%  [RESC1005X40X25ML05T10]
R82  0R 0402 1%  [RESC1005X40X25ML05T10]
S2  TS-1088-AR02016  [TS1088AR02016]
U1  ESP32-S3-WROOM-1-N8  [ESP32S3WROOM1N8R2]

### Blocks framed on the sheet
BOOT: S2
UART PROGRAMMING: J1

### Ports
IO_1, IO_2, IO_4, IO_5, IO_6, IO_7, IO_8, IO_9, IO_10, IO_11, IO_12, IO_13, IO_14, IO_15, IO_16, IO_17, IO_18, IO_19, IO_20, IO_21, IO_35, IO_36, IO_37, IO_38, IO_45, IO_47, IO_48

### Nets
3v3_dig@2A: C2.2 C3.2 J1.2 R1.2 R2.2 R5.1 R6.1 R81.2 U1.2(3V3)
DGND: C1.1 C2.1 C3.1 J1.4 R3.1 R4.1 R82.2 S2.2(NO) U1.1(GND_1) U1.40(GND_2) U1.41(GND_3) U1.42(GND_4) U1.43(GND_5) U1.44(GND_6) U1.45(GND_7) U1.46(GND_8) U1.47(GND_9) U1.48(GND_10) U1.49(GND_11)
AFE_CS: U1.23(IO21) ; port IO_21
AFE_LED_ALM: U1.7(IO7) ; port IO_7
AFE_READY: U1.10(IO17) ; port IO_17
BABY_TEMP: U1.12(IO8) ; port IO_8
D_N: U1.13(IO19) ; port IO_19
D_P: U1.14(IO20) ; port IO_20
DEBUG_RX: J1.5 U1.36(RXD0)
DEBUG_TX: J1.3 U1.37(TXD0)
ESP32_EN: C1.2 J1.1 R1.1 U1.3(EN)
ESP32_IO0: J1.6 R2.1 S2.1(COM) U1.27(IO0)
GSM_RX: U1.18(IO10) ; port IO_10
GSM_TX: U1.17(IO9) ; port IO_9
SCL: R5.2 U1.25(IO48) ; port IO_48
SDA: R6.2 U1.24(IO47) ; port IO_47
SPI_MISO: U1.30(IO37) ; port IO_37
SPI_MOSI: U1.28(IO35) ; port IO_35
SPI_SCK: U1.29(IO36) ; port IO_36
NetD14_2: U1.38(IO2) ; port IO_2
NetJ5_3: U1.31(IO38) ; port IO_38
NetJ5_4: U1.19(IO11) ; port IO_11
NetJ10_4: U1.9(IO16) ; port IO_16
NetJ10_6: U1.8(IO15) ; port IO_15
NetR3_2: R3.2 U1.26(IO45) ; port IO_45
NetR4_2: R4.2 U1.16(IO46)
NetR10_2: U1.22(IO14) ; port IO_14
NetR14_1: U1.20(IO12) ; port IO_12
NetR22_1: U1.21(IO13) ; port IO_13
NetR47_1: U1.39(IO1) ; port IO_1
NetR75_1: U1.4(IO4) ; port IO_4
NetR81_1: R81.1 R82.1 U1.15(IO3)
NetR83_2: U1.11(IO18) ; port IO_18
NetU1_5: U1.5(IO5) ; port IO_5
NetU1_6: U1.6(IO6) ; port IO_6

Not connected (* = marked no-connect by the designer): U1 32(IO39) 33(IO40) 34(IO41) 35(IO42)

### Notes on the sheet
- Title
- Size:
- Date:
- A3
- Author:
- Time:
- Revision:
- Sheet
- of
- File:

### Library data of the parts
C1-C3 = CMP-1662-00020-1: ComponentLink2Description: Datasheet; ComponentLink2URL: http://psearch.en.murata.com/capacitor/product/GRM155R60J105KE19%23.pdf; ComponentLink1Description: Manufacturer URL; ComponentLink1URL: http://www.murata.com/
  C1: LCSC_PN: C1518208
  C2: LCSC_PN: C77000
  C3: LCSC_PN: C77020
J1 = CMP-bcf575fbeff46332-1: Dual Row Connector Female Samtec SLW-103-01-T-D; Lead-Free Status: Lead Free; Number of Contacts: 6; Pin Pitch: 2.54 mm; Voltage Rating (AC): 400 V; Gender: Female; Color: Black; Octopart URL: https://octopart.com/slw-103-01-t-d-samtec-292455; Mounting Style: Through Hole, Vertical; Contact Plating: Tin; OctopartID: bcf575fbeff46332; Operating Temperature: 105 °C (max); Size-Width: 4.95 mm; Housing Material: Plastic; Size-Length: 7.62 mm; Number of Rows: 2; Size-Height: 4.57 mm; Packaging: Tube; RoHS: Compliant; Contact Material: Phosphor Bronze; Number of Positions: 6; Housing Color: Black; REACH SVHC Compliance: No SVHC; Manufacturer Part Number: SLW-103-01-T-D; LCSC_PN: C492420
R1-R6 R81 R82 = CMP-2002-07472-1
  R1-R4 R81: LCSC_PN: C190095
  R5 R6: LCSC_PN: C105871
  R82: LCSC_PN: C60485
S2 = TS-1088-AR02016: Switch; Manufacturer_Name: XUNPU; Datasheet Link: https://www.xunpudianzi.com/uploads/pdf/TS-1088-ARXXX.pdf; Height: 2mm; Manufacturer_Part_Number: TS-1088-AR02016; LCSC_PN: C720477
U1 = ESP32-S3-WROOM-1-N8: Integrated Circuit; Manufacturer_Name: Espressif Systems; Datasheet Link: https://www.espressif.com/sites/default/files/documentation/esp32-s3-wroom-1_wroom-1u_datasheet_en.pdf; Height: 3.25mm; Manufacturer_Part_Number: ESP32-S3-WROOM-1-N8; Mouser Part Number: 356-ESP32-S3WROOM1N8; Mouser Price/Stock: https://www.mouser.co.uk/ProductDetail/Espressif-Systems/ESP32-S3-WROOM-1-N8?qs=Wj%2FVkw3K%252BMC1mq0KGPvoSQ%3D%3D; LCSC_PN: C2913198

## Sheet PowerInput.SchDoc: Power
size A3; SheetNumber: 2; SheetTotal: 10
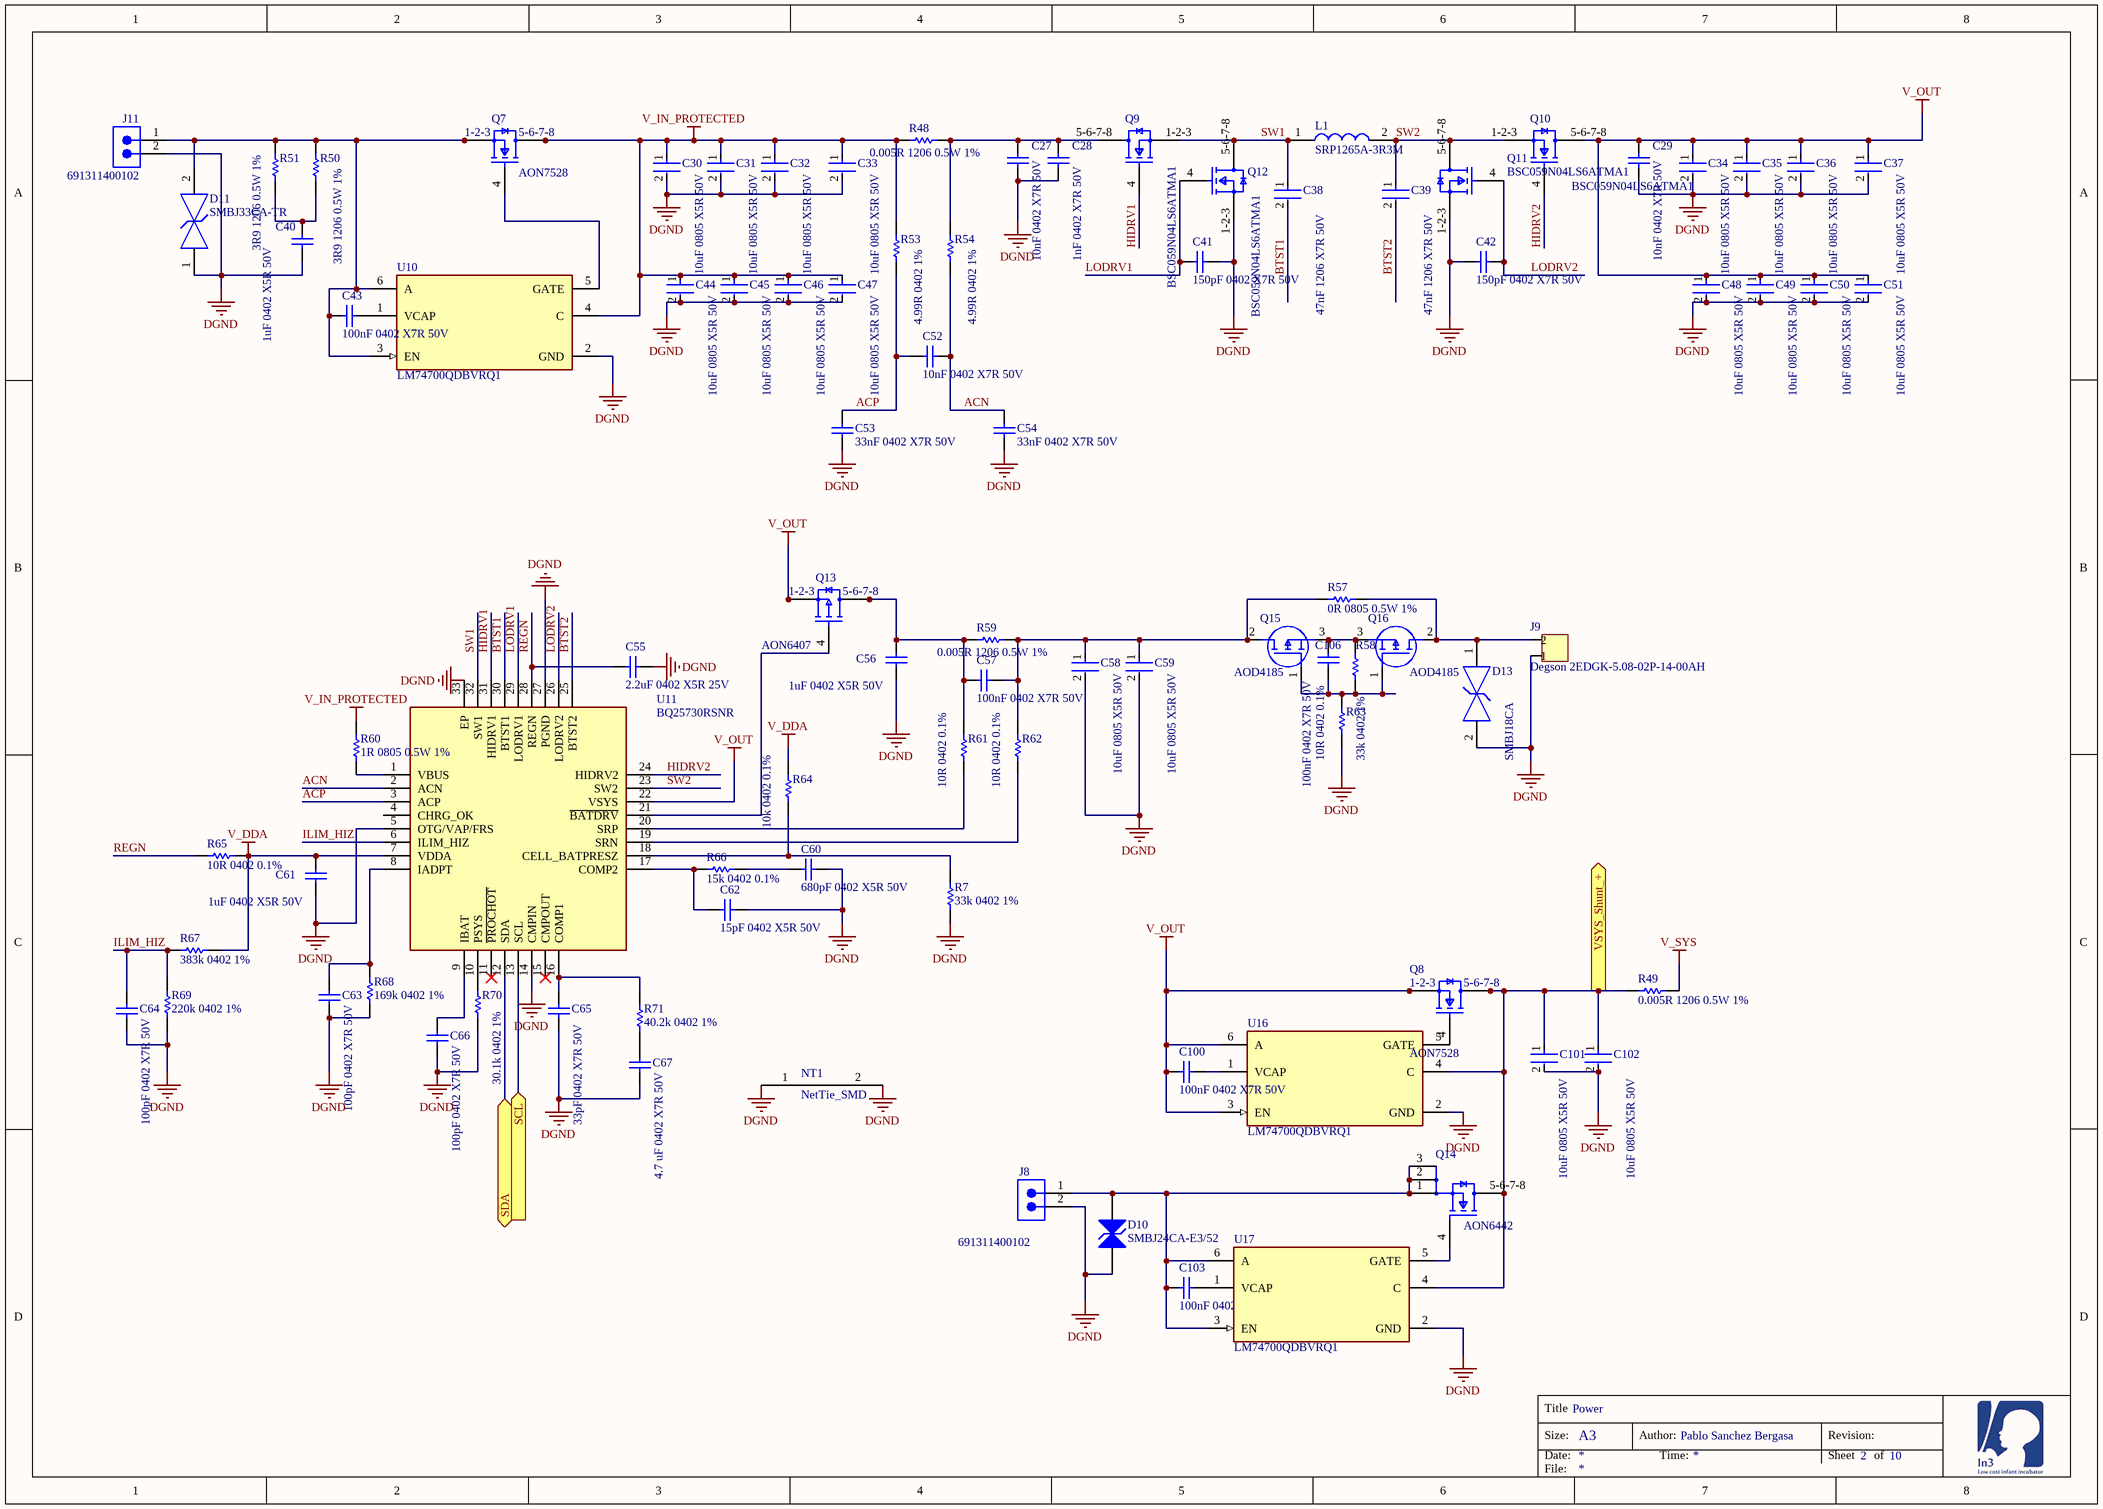
[diagram p5: PowerInput.SchDoc]

### Parts
C27  10nF 0402 X7R 50V  [CAPC1005X55X25NL5T10]
C28  1nF 0402 X7R 50V  [CAPC1005X55X25NL5T10]
C29  10nF 0402 X7R 50V  [CAPC1005X55X25NL5T10]
C30  10uF 0805 X5R 50V  [FP-GRM21B-0_2-e0_2_0_7-MFG]
C31  10uF 0805 X5R 50V  [FP-GRM21B-0_2-e0_2_0_7-MFG]
C32  10uF 0805 X5R 50V  [FP-GRM21B-0_2-e0_2_0_7-MFG]
C33  10uF 0805 X5R 50V  [FP-GRM21B-0_2-e0_2_0_7-MFG]
C34  10uF 0805 X5R 50V  [FP-GRM21B-0_2-e0_2_0_7-MFG]
C35  10uF 0805 X5R 50V  [FP-GRM21B-0_2-e0_2_0_7-MFG]
C36  10uF 0805 X5R 50V  [FP-GRM21B-0_2-e0_2_0_7-MFG]
C37  10uF 0805 X5R 50V  [FP-GRM21B-0_2-e0_2_0_7-MFG]
C38  47nF 1206 X7R 50V  [FP-CC1206-FD-MFG]
C39  47nF 1206 X7R 50V  [FP-CC1206-FD-MFG]
C40  1uF 0402 X5R 50V  [CAPC1005X55X25NL5T10]
C41  150pF 0402 X7R 50V  [CAPC1005X55X25NL5T10]
C42  150pF 0402 X7R 50V  [CAPC1005X55X25NL5T10]
C43  100nF 0402 X7R 50V  [CAPC1005X55X25NL5T10]
C44  10uF 0805 X5R 50V  [FP-GRM21B-0_2-e0_2_0_7-MFG]
C45  10uF 0805 X5R 50V  [FP-GRM21B-0_2-e0_2_0_7-MFG]
C46  10uF 0805 X5R 50V  [FP-GRM21B-0_2-e0_2_0_7-MFG]
C47  10uF 0805 X5R 50V  [FP-GRM21B-0_2-e0_2_0_7-MFG]
C48  10uF 0805 X5R 50V  [FP-GRM21B-0_2-e0_2_0_7-MFG]
C49  10uF 0805 X5R 50V  [FP-GRM21B-0_2-e0_2_0_7-MFG]
C50  10uF 0805 X5R 50V  [FP-GRM21B-0_2-e0_2_0_7-MFG]
C51  10uF 0805 X5R 50V  [FP-GRM21B-0_2-e0_2_0_7-MFG]
C52  10nF 0402 X7R 50V  [CAPC1005X55X25NL5T10]
C53  33nF 0402 X7R 50V  [CAPC1005X55X25NL5T10]
C54  33nF 0402 X7R 50V  [CAPC1005X55X25NL5T10]
C55  2.2uF 0402 X5R 25V  [CAPC1005X55X25NL5T10]
C56  1uF 0402 X5R 50V  [CAPC1005X55X25NL5T10]
C57  100nF 0402 X7R 50V  [CAPC1005X55X25NL5T10]
C58  10uF 0805 X5R 50V  [FP-GRM21B-0_2-e0_2_0_7-MFG]
C59  10uF 0805 X5R 50V  [FP-GRM21B-0_2-e0_2_0_7-MFG]
C60  680pF 0402 X5R 50V  [CAPC1005X55X25NL5T10]
C61  1uF 0402 X5R 50V  [CAPC1005X55X25NL5T10]
C62  15pF 0402 X5R 50V  [CAPC1005X55X25NL5T10]
C63  100pF 0402 X7R 50V  [CAPC1005X55X25NL5T10]
C64  100pF 0402 X7R 50V  [CAPC1005X55X25NL5T10]
C65  33pF 0402 X7R 50V  [CAPC1005X55X25NL5T10]
C66  100pF 0402 X7R 50V  [CAPC1005X55X25NL5T10]
C67  4.7 uF 0402 X7R 50V  [CAPC1005X55X25NL5T10]
C100  100nF 0402 X7R 50V  [CAPC1005X55X25NL5T10]
C101  10uF 0805 X5R 50V  [FP-GRM21B-0_2-e0_2_0_7-MFG]
C102  10uF 0805 X5R 50V  [FP-GRM21B-0_2-e0_2_0_7-MFG]
C103  100nF 0402 X7R 50V  [CAPC1005X55X25NL5T10]
C106  100nF 0402 X7R 50V  [CAPC1005X55X25NL5T10]
D10  SMBJ24CA-E3/52  [VISH-DO-214AA-A-2_V]
D11  SMBJ33CA-TR  [FP-SMB-CA-MFG]
D13  SMBJ18CA  [FP-SMBJ-MFG]
J8  691311400102  [691311400102]
J9  Degson 2EDGK-5.08-02P-14-00AH  [PCB-h4cyb3wxd4gf7j132tzl-1]
J11  691311400102  [691311400102]
L1  SRP1265A-3R3M  [INDPM135125X650N]
NT1  NetTie_SMD  [NETTIE_SMD]  (net tie, no BOM)
Q7  AON7528  [AON7520]
Q8  AON7528  [AON7520]
Q9  BSC059N04LS6ATMA1  [FP-PG-TDSON-8-MFG]
Q10  BSC059N04LS6ATMA1  [FP-PG-TDSON-8-MFG]
Q11  BSC059N04LS6ATMA1  [FP-PG-TDSON-8-MFG]
Q12  BSC059N04LS6ATMA1  [FP-PG-TDSON-8-MFG]
Q13  AON6407  [AON6414A]
Q14  AON6442  [FP-DFN5x6_8L_EP1_P-MFG]
Q15  AOD4185  [AOD4185]
Q16  AOD4185  [AOD4185]
R7  33k 0402 1%  [RESC1005X40X25ML05T10]
R48  0.005R 1206 0.5W 1%  [CAPC3216X180X55ML20T25]
R49  0.005R 1206 0.5W 1%  [CAPC3216X180X55ML20T25]
R50  3R9 1206 0.5W 1%  [CAPC3216X180X55ML20T25]
R51  3R9 1206 0.5W 1%  [CAPC3216X180X55ML20T25]
R53  4.99R 0402 1%  [RESC1005X40X25ML05T10]
R54  4.99R 0402 1%  [RESC1005X40X25ML05T10]
R57  0R 0805 0.5W 1%  [RESC2013X65X40LL15T20]
R58  33k 0402 1%  [RESC1005X40X25ML05T10]
R59  0.005R 1206 0.5W 1%  [CAPC3216X180X55ML20T25]
R60  1R 0805 0.5W 1%  [RESC2013X65X40LL15T20]
R61  10R 0402 0.1%  [RESC1005X40X25ML05T10]
R62  10R 0402 0.1%  [RESC1005X40X25ML05T10]
R63  10R 0402 0.1%  [RESC1005X40X25ML05T10]
R64  10k 0402 0.1%  [RESC1005X40X25ML05T10]
R65  10R 0402 0.1%  [RESC1005X40X25ML05T10]
R66  15k 0402 0.1%  [RESC1005X40X25ML05T10]
R67  383k 0402 1%  [RESC1005X40X25ML05T10]
R68  169k 0402 1%  [RESC1005X40X25ML05T10]
R69  220k 0402 1%  [RESC1005X40X25ML05T10]
R70  30.1k 0402 1%  [RESC1005X40X25ML05T10]
R71  40.2k 0402 1%  [RESC1005X40X25ML05T10]
U10  LM74700QDBVRQ1  [FP-DBV0006A-MFG]
U11  BQ25730RSNR  [QFN40P400X400X80-33N-D]
U16  LM74700QDBVRQ1  [FP-DBV0006A-MFG]
U17  LM74700QDBVRQ1  [FP-DBV0006A-MFG]

### Ports
SCL (in), SDA (bidir), VSYS_Shunt_+ (out)

### Nets
DGND: C27.1 C28.1 C29.1 C30.2 C31.2 C32.2 C33.2 C34.2 C35.2 C36.2 C37.2 C40.1 C41.1 C42.1 C44.2 C45.2 C46.2 C47.2 C48.2 C49.2 C50.2 C51.2 C53.2 C54.2 C55.1 C56.1 C58.2 C59.2 C60.1 C61.1 C62.1 C63.2 C64.2 C65.2 C66.2 C67.2 C101.2 C102.2 D10.1(A) D11.1 D13.2 J8.2 J9.1 J11.2 NT1.1 NT1.2 Q11.1-2-3(S) Q12.1-2-3(S) R7.2 R63.1 R68.2 R69.2 R70.2 U10.2(GND) U11.5(OTG/VAP/FRS) U11.14(CMPIN) U11.27(PGND) U11.33(EP) U16.2(GND) U17.2(GND)
V_DDA: C61.2 R64.2 R65.1 R67.1 U11.7(VDDA)
V_IN_PROTECTED: C30.1 C31.1 C32.1 C33.1 C44.1 C45.1 C46.1 C47.1 Q7.5(D) Q7.6(D) Q7.7(D) Q7.8(D) Q7.9(D) R48.2 R53.2 R60.2 U10.4(C)
V_OUT: C29.2 C34.1 C35.1 C36.1 C37.1 C48.1 C49.1 C50.1 C51.1 C100.2 Q8.1(1-2-3) Q8.2(S) Q8.3(S) Q10.5-6-7-8(D) Q13.1(1-2-3) Q13.2(S) Q13.3(S) U11.22(VSYS) U16.3(EN) U16.6(A)
V_SYS: R49.1
ACN: C52.1 C54.1 R54.1 U11.2(ACN)
ACP: C52.2 C53.1 R53.1 U11.3(ACP)
BTST1: C38.2 U11.30(BTST1)
BTST2: C39.2 U11.25(BTST2)
HIDRV1: Q9.4(G) U11.31(HIDRV1)
HIDRV2: Q10.4(G) U11.24(HIDRV2)
ILIM_HIZ: C64.1 R67.2 R69.1 U11.6(ILIM_HIZ)
LODRV1: C41.2 Q12.4(G) U11.29(LODRV1)
LODRV2: C42.2 Q11.4(G) U11.26(LODRV2)
REGN: C55.2 R65.2 U11.28(REGN)
SCL: U11.13(SCL) ; port SCL
SDA: U11.12(SDA) ; port SDA
SW1: C38.1 L1.1 Q9.1-2-3(S) Q12.5-6-7-8(D) U11.32(SW1)
SW2: C39.1 L1.2 Q10.1-2-3(S) Q11.5-6-7-8(D) U11.23(SW2)
Vsense+: C101.1 C102.1 Q8.5(D) Q8.6(D) Q8.7(D) Q8.8(D) Q8.9(D) Q14.5-6-7-8(D) R49.2 U16.4(C) U17.4(C) ; port VSYS_Shunt_+
NetC27_2: C27.2 C28.2 Q9.5-6-7-8(D) R48.1 R54.2
NetC40_2: C40.2 R50.2 R51.2
NetC43_1: C43.1 U10.1(VCAP)
NetC43_2: C43.2 D11.2 J11.1 Q7.1(1-2-3) Q7.2(S) Q7.3(S) R50.1 R51.1 U10.3(EN) U10.6(A)
NetC56_2: C56.2 C57.2 Q13.5(D) Q13.6(D) Q13.7(D) Q13.8(D) Q13.9(D) R59.2 R61.2
NetC57_1: C57.1 C58.1 C59.1 Q15.2(D) R57.1 R59.1 R62.2
NetC60_2: C60.2 R66.1
NetC62_2: C62.2 R66.2 U11.17(COMP2)
NetC63_1: C63.1 R68.1 U11.8(IADPT)
NetC65_1: C65.1 R71.1 U11.16(COMP1)
NetC66_1: C66.1 U11.9(IBAT)
NetC67_1: C67.1 R71.2
NetC100_1: C100.1 U16.1(VCAP)
NetC103_1: C103.1 U17.1(VCAP)
NetC103_2: C103.2 D10.2(A) J8.1 Q14.1(S) Q14.2(S) Q14.3(S) U17.3(EN) U17.6(A)
NetC106_1: C106.1 Q15.3(S) Q16.3(S) R58.1
NetC106_2: C106.2 Q15.1(G) Q16.1(G) R58.2 R63.2
NetD13_1: D13.1 J9.2 Q16.2(D) R57.2
NetQ7_4: Q7.4(G) U10.5(GATE)
NetQ8_4: Q8.4(G) U16.5(GATE)
NetQ13_4: Q13.4(G) U11.21(~{BATDRV})
NetQ14_4: Q14.4(G) U17.5(GATE)
NetR7_1: R7.1 R64.1 U11.18(CELL_BATPRESZ)
NetR60_1: R60.1 U11.1(VBUS)
NetR61_1: R61.1 U11.20(SRP)
NetR62_1: R62.1 U11.19(SRN)
NetR70_1: R70.1 U11.10(PSYS)

Not connected (* = marked no-connect by the designer): U11 4(CHRG_OK) 11(~{PROCHOT})* 15(CMPOUT)*

### Notes on the sheet
- Title
- Size:
- Date:
- A3
- Author:
- Time:
- Revision:
- Sheet
- of
- File:
- (in symbol AON6407) 5-6-7-8
- (in symbol AON7528) 5-6-7-8

### Library data of the parts
C27-C29 C40-C43 C52-C57 C60-C67 C100 C103 C106 = CMP-1662-00020-1: ComponentLink2Description: Datasheet; ComponentLink2URL: http://psearch.en.murata.com/capacitor/product/GRM155R60J105KE19%23.pdf; ComponentLink1Description: Manufacturer URL; ComponentLink1URL: http://www.murata.com/
  C27 C29 C52: LCSC_PN: C60133
  C28: LCSC_PN: C93920
  C40 C56 C61: LCSC_PN: C1518208
  C41 C42: LCSC_PN: C113789
  C43 C57 C100 C103 C106: LCSC_PN: C77020
  C53 C54: LCSC_PN: C106862
  C55: LCSC_PN: C77002
  C60: LCSC_PN: C307451
  C62: LCSC_PN: C86285
  C63 C64 C66: LCSC_PN: C281751
  C65: LCSC_PN: C107005
  C67: LCSC_PN: C23733
C30-C37 C44-C51 C58 C59 C101 C102 = CMP-06035-048920-1: Chip Multilayer Ceramic Capacitors for General Purpose, 0805, 10uF, X5R, 15%, 10%, 35V; Max Operating Temperature: 85°C; REACH SVHC: No SVHC; Packaging: Tape and Reel; Thickness: 0.057inch; Tolerance: 10%; Capacitance: 10uF; Case Code (Imperial): 0805; Height: 1.25mm; Width: 0.049inch; Length: 0.079inch; Lead Free: Lead Free; Voltage Rating: 35V; Case/Package: 0805; Dielectric: X5R; Min Operating Temperature: -55°C; Package Quantity: 3000; Termination: SMD/SMT; Case Code (Metric): 2012; Weight: 0.000335oz; Mount: Surface Mount; Voltage Rating (DC): 35V; LCSC_PN: C2932476
C38 C39 = CMP-03422-001420-1: CAP CER 10UF 50V X5R 1206; Tolerance: 10%; Voltage Rating (DC): 50V; Width: 0.063inch; Halogen Free: Halogen Free; Mount: Surface Mount; Dielectric: X5R; Max Operating Temperature: 85°C; Capacitance: 47nF; Case/Package: 1206; Voltage Rating: 50V; Lead Free: Lead Free; Thickness: 0.075inch; Min Operating Temperature: -55°C; Length: 0.126inch; Packaging: Tape and Reel; RoHS Compliant: Yes; LCSC_PN: C107209
D10 = CMP-2000-07094-1: TRANSZORB(R) Transient Voltage Suppressor, 24 V, -55 to 150 degC, 2-Pin DO-214AA (SMBJ), RoHS, Tape and Reel; Manufacturer: Vishay; Clamping Voltage Vc Max: 38.9V; Peak Pulse Current Ippm: 14A; Product Range: TRANSZORBSMBJSeries; Power Dissipation Pd: 600W; Breakdown Voltage Min: 26.7V; No. of Pins: 2Pins; SVHC: ToBeAdvised; Breakdown Voltage Max: 29.5V; TVS Polarity: Bidirectional; Reverse Stand-Off Voltage Vrwm: 24V; Mounting Technology: SurfaceMount; Package Reference: DO-214AA; Package Description: 2-Pin Surface Mount Device, Body 4.315 x 3.62 mm; Diode Case Style: DO-214AA; Packaging: CutTape; Datasheet URL: http://www.vishay.com/docs/88392/smbj50a.pdf; Peak Pulse Power Dissipation: 600W; Manufacturer URL: http://www.vishay.com/; Datasheet Version: 02/2014; LCSC_PN: C83268
D11 = CMP-12225-000040-1: TVS DIODE 33V 69.7V SMB; Manufacturer: STMicroelectronics; Direction: Bidirectional; Peak Pulse Current: 11.8A; Peak Pulse Power: 600W; Clamping Voltage: 53.3V; Breakdown Voltage: 36.7V; Number Of Channels: 1; Standoff Height: 0.05mm; Max Junction Temp: +150°C; Lead Free: Yes; Device Class L1: Circuit Protection; Device Class L3: unset; Mouser Description: TVS Diodes - Transient Voltage Suppressors 600W 33V Bidirect; Device Class L2: TVS Diodes; Temperature Range High: +150°C; Temperature: -55°C to +150°C; Temperature Range Low: -55°C; Octopart: https://octopart.com/smbj33ca-tr-stmicroelectronics-347069; Manufacturer Part Number: SMBJ33CA-TR; Automotive: No; ComponentLink2URL: https://www.st.com/resource/en/datasheet/smbj.pdf; RoHS: TRUE; Package: SMB-CA; Category: Diode; ComponentLink2Description: Datasheet; Height: 2.65mm; Reverse Standoff Voltage: 33V; Digikey Description: TVS DIODE 33V 69.7V SMB; LCSC_PN: C83325
D13 = CMP-08607-000021-1: TVS DIODE 18V 29.2V DO214AA; Manufacturer: Littelfuse Inc; Number Of Channels: 1; Peak Pulse Power: 600W; Max Junction Temp: +150°C; Peak Pulse Current: 20.6A; Direction: Bidirectional; Breakdown Voltage: 20V; RoHS: TRUE; Lead Free: Yes; Category: Diode; Clamping Voltage: 29.2V; Height: 2.61mm; Manufacturer Part Number: SMBJ18CA; Reverse Standoff Voltage: 18V; Device Class L3: unset; Device Class L2: TVS Diodes; Package: SMBJ; Digikey Description: TVS DIODE 18V 29.2V DO214AA; Device Class L1: Circuit Protection; ComponentLink2Description: Datasheet; ComponentLink2URL: https://www.littelfuse.com/~/media/electronics/datasheets/tvs_diodes/littelfuse_tvs_diode_smbj_datasheet.pdf.pdf; Temperature: -65°C to +150°C; Temperature Range High: +150°C; Mouser Description: SMBJ Series 29.2 V 0.6 kW Surface Mount Bi-Directional TVS Diode - DO-214AA; Automotive: No; Octopart: https://octopart.com/smbj18ca-littelfuse-350695; Temperature Range Low: -65°C; LCSC_PN: C83327
J8 J11 = CMP-1502-02408-3: 7.62MM Pitch Straight Pluggable Term Block, Pcb Header, Through Hole, 2 Way; Number of Positions Per Level: 2; Gender: Male; Number of Levels: 1; Voltage: 300V; Current: 20A; Contact Gender: Male; Termination: Solder; Mount: Through Hole; Height: 16mm; Pitch: 7.62mm; Orientation: Vertical; Number of Rows: 1; Packaging: Box; Lead Pitch: 7.62mm; Contact Material: Brass; Width: 15.24mm; Number of Contacts: 2; RoHS: Compliant; Color: Green; Length: 8.5mm; Number of Pins: 2; Current Rating: 20A; LCSC_PN: C19724644
J9 = CMP-7a42b7ee166ba585-1: Terminal block, 5mm 2 Pos, through hole male.; Manufacturer Part Number: 2EDGK-5.08-02P-14-00AH + 2EDGVC-5.08-02P; Octopart URL: https://octopart.com/2edgk-5.08-02p-14-00ah-degson-78006607; OctopartID: 7a42b7ee166ba585; Manufacturer Part Number 2: WJ2EDGVC-5.08-2P + WJ2EDGK-5.08-2P; LCSC_PN: C8445
L1 = SRP1265A-3R3M: Inductor; Manufacturer_Name: Bourns; Datasheet Link: https://www.bourns.com/data/global/pdfs/SRP1265A.pdf; Height: 6.5mm; Manufacturer_Part_Number: SRP1265A-3R3M; Mouser Part Number: 652-SRP1265A-3R3M; Mouser Price/Stock: https://www.mouser.co.uk/ProductDetail/Bourns/SRP1265A-3R3M?qs=7z%252BmIopC6%2FKn2Zz%252BiwrXSg%3D%3D; Arrow Part Number: SRP1265A-3R3M; Arrow Price/Stock: https://www.arrow.com/en/products/srp1265a-3r3m/bourns?utm_currency=USD&region=nac; LCSC_PN: C19268665
NT1 = NetTie_SMD: Net Tie SMD
Q7 Q8 = AON7528: MOSFET (N-Channel); Manufacturer_Name: Alpha & Omega Semiconductors; Datasheet Link: http://aosmd.com/res/data_sheets/AON7528.pdf; Manufacturer_Part_Number: AON7528; Arrow Part Number: AON7528; Arrow Price/Stock: https://www.arrow.com/en/products/aon7528/alpha-and-omega-semiconductor?utm_currency=USD&region=nac; LCSC_PN: C5297617
Q9-Q12 = CMP-32901-000139-1: TRENCH <= 40V; Manufacturer: Infineon; Transconductance: 100S; Turn On Delay Time: 3ns; Number Of Channels: 1; Gate Charge At Vgs: 9.4nC @ 10V; Continuous Drain Current: 17A; Max Junction Temp: +175°C; Reverse Recovery Charge: 22nC; Turn Off Delay Time: 8ns; Input Capacitace At Vds: 640pF @ 20V; Typ Forward Diode Voltage: 0.92V; Threshold Vgs Max: 2.3V; Max Forward Diode Voltage: 1V; Power Dissipation: 3W; Depletion Mode: False; Threshold Vgs Min: 1.3V; Gate To Source Voltage: 20V; Pulse Drain Current: 236A; Reverse Recovery Time: 13ns; Rthja Max: 50°C/W; Drain To Source Resistance: 4.7mΩ; Temperature Range High: +175°C; Package: PG-TDSON-8; Digikey Description: TRENCH <= 40V; Temperature Range Low: -55°C; Footprint Url: https://www.infineon.com/cms/en/product/packages/PG-TDSON/PG-TDSON-8-17/; Number Of N Channels: 1; Drain To Source Voltage: 40V; RoHS: TRUE; Temperature: -55°C to +175°C; Category: Trans; ComponentLink2URL: https://www.infineon.com/dgdl/Infineon-BSC059N04LS6-DS-v02_00-EN.pdf?fileId=5546d462689a790c0168bd22cfc6481f; Drain To Source Breakdown Voltage: 40V; Device Class L2: Transistors; Manufacturer Part Number: BSC059N04LS6ATMA1; ComponentLink2Description: Datasheet; Device Class L3: MOSFETs; Height: 1.1mm; Automotive: No; Octopart: https://octopart.com/bsc059n04ls6atma1-infineon-98039929; Lead Free: Yes; Device Class L1: Discrete Semiconductors; LCSC_PN: C534356
Q13 = AON6407: MOSFET (P-Channel); Manufacturer_Name: Alpha & Omega Semiconductors; Datasheet Link: http://www.aosmd.com/res/data_sheets/AON6407.pdf; Manufacturer_Part_Number: AON6407; Arrow Part Number: AON6407; Arrow Price/Stock: https://www.arrow.com/en/products/aon6407/alpha-and-omega-semiconductor?utm_currency=USD&region=nac; LCSC_PN: C13899
Q14 = CMP-83955-000025-1: MOSFET N-CH 40V 22A/32A 8DFN; Max Power Dissipation: 35.7W; Rds On Max: 4.8mR; Input Capacitance: 2.2nF; Continuous Drain Current (ID): 32A; Max Operating Temperature: 150°C; Mount: Surface Mount; Min Operating Temperature: -55°C; Series: -; Package Quantity: 3000; Packaging: Cut Tape; RoHS Compliant: Yes; Case/Package: DFN; Drain to Source Voltage (Vdss): 40V; LCSC_PN: C182465
Q15 Q16 = AOD4185: MOSFET (P-Channel); Manufacturer_Name: Alpha & Omega Semiconductors; Datasheet Link: http://aosmd.com/res/data_sheets/AOD4185.pdf; Height: 2.4mm; Manufacturer_Part_Number: AOD4185; Arrow Part Number: AOD4185; Arrow Price/Stock: https://www.arrow.com/en/products/aod4185/alpha-and-omega-semiconductor?utm_currency=USD&region=europe; LCSC_PN: C400894
R7 R53 R54 R58 R61-R71 = CMP-2002-07472-1
  R7 R58: LCSC_PN: C138003
  R53 R54: LCSC_PN: C844114
  R61-R63 R65: LCSC_PN: C138066
  R64: LCSC_PN: C190095
  R66: LCSC_PN: C852545
  R67: LCSC_PN: C2076791
  R68: LCSC_PN: C327367
  R69: LCSC_PN: C138030
  R70: LCSC_PN: C138009
  R71: LCSC_PN: C137983
R48-R51 R59 = CMP-0abdc173b10ad57a-1: Manufacturer Part Number: WSLP12065L000FEA; Resistance: 0,024; Power: 1W; Octopart URL: https://octopart.com/1-2176055-0-te+connectivity-46440145; Case/Package: 1206; Lifecycle Status: Not Listed by Manufacturer; Packaging: Tape & Reel (TR); OctopartID: 0abdc173b10ad57a; OrderingCode: WSLP12065L000FEA; Manufacturer Part Number 2: FMF06FTHR005-LHL
  R48 R49 R59: LCSC_PN: C728276
  R50 R51: LCSC_PN: C17885
R57 R60 = CMP-2000-07514-1: Chip Resistor, 0 Ohm, 0.125 W, -55 to 125 degC, 0805 (2012 Metric), RoHS, Tape and Reel; Manufacturer: TE Connectivity; Power Rating: 125mW; Voltage Rating: 150V; Tolerance: 0%; Case\/Package: 0805; Number of Resistors: 1; Resistance: 0mOhm; Datasheet URL: www.te.com/commerce/DocumentDelivery/DDEController?Action=showdoc&DocId=Customer+Drawing%7F1623401%7FBA%7Fpdf%7FEnglish%7FENG_CD_1623401_BA.pdf%7F1623401-1; Composition: ThickFilm; Max Operating Temperature: 125degC; Min Operating Temperature: -55degC; ELV: Compliant; Case Code (Metric): 2012; Number of Terminations: 2; Weight: 0.000194oz; Length: 2mm; Mount: SurfaceMount; Packaging: TapeandReel; Case Code (Imperial): 0805; RoHSCompliant: true; Width: 1.25mm; Radiation Hardening: No; Termination: Solder; Manufacturer URL: http://www.te.com/; Package Description: 2-Pin Surface Mount Device, Body 2 x 1.25 mm; Mounting Technology: SurfaceMount; Height: 0.55mm; Package Quantity: 5000; Package Reference: RESC2013X65X40L15T20; Datasheet Version: Rev. BA, 12/2009; Depth: 1.25mm
  R57: LCSC_PN: C100045
  R60: LCSC_PN: C144579
U10 U16 U17 = CMP-04910-000003-1: POWER MANAGEMENT; Manufacturer: Texas Instruments; Number Of Outputs: 1; Standoff Height: 0mm; Automotive Grade: Grade 1; Nominal Supply Current: 80uA; Max Junction Temp: +150°C; Max Supply Voltage: 65V; Min Supply Voltage: 3.2V; Octopart: https://octopart.com/lm74700qdbvrq1-texas+instruments-87700446; Height: 1.45mm; Manufacturer Part Number: LM74700QDBVRQ1; Mouser Description: Low Iq, ideal diode controller 6-SOT-23 -40 to 125; Lead Free: Yes; Package: DBV0006A; Device Class L1: Integrated Circuits (ICs); Ambient Temperature Range Low: -40°C; Device Class L2: Power Management ICs; Category: IC; Ambient Temperature Range High: +125°C; RoHS: TRUE; Temperature Range Low: -40°C; Automotive: Yes; Temperature: -40°C to +125°C; Temperature Range High: +125°C; Device Class L3: unset; ComponentLink2URL: http://www.ti.com/lit/ds/symlink/lm74700-q1.pdf; ComponentLink2Description: Datasheet; Digikey Description: POWER MANAGEMENT; LCSC_PN: C2941042
U11 = BQ25730RSNR: Integrated Circuit; Manufacturer_Name: Texas Instruments; Datasheet Link: https://www.ti.com/lit/ds/symlink/bq25730.pdf?ts=1623420063043&ref_url=https%253A%252F%252Fwww.ti.com%252Fstore%252Fti%252Fen%252Fp%252Fproduct%252F%253Fp%253DBQ25730RSNR; Height: 0.8mm; Manufacturer_Part_Number: BQ25730RSNR; Mouser Part Number: 595-BQ25730RSNR; Mouser Price/Stock: https://www.mouser.co.uk/ProductDetail/Texas-Instruments/BQ25730RSNR?qs=stqOd1AaK78USmb51n%2Fwlg%3D%3D; Arrow Part Number: BQ25730RSNR; Arrow Price/Stock: https://www.arrow.com/en/products/bq25730rsnr/texas-instruments?region=nac; LCSC_PN: C5219071